# Altium schematic sheet Tu_Nguon_2.SchDoc
size A0; SheetNumber: 1; SheetTotal: 12
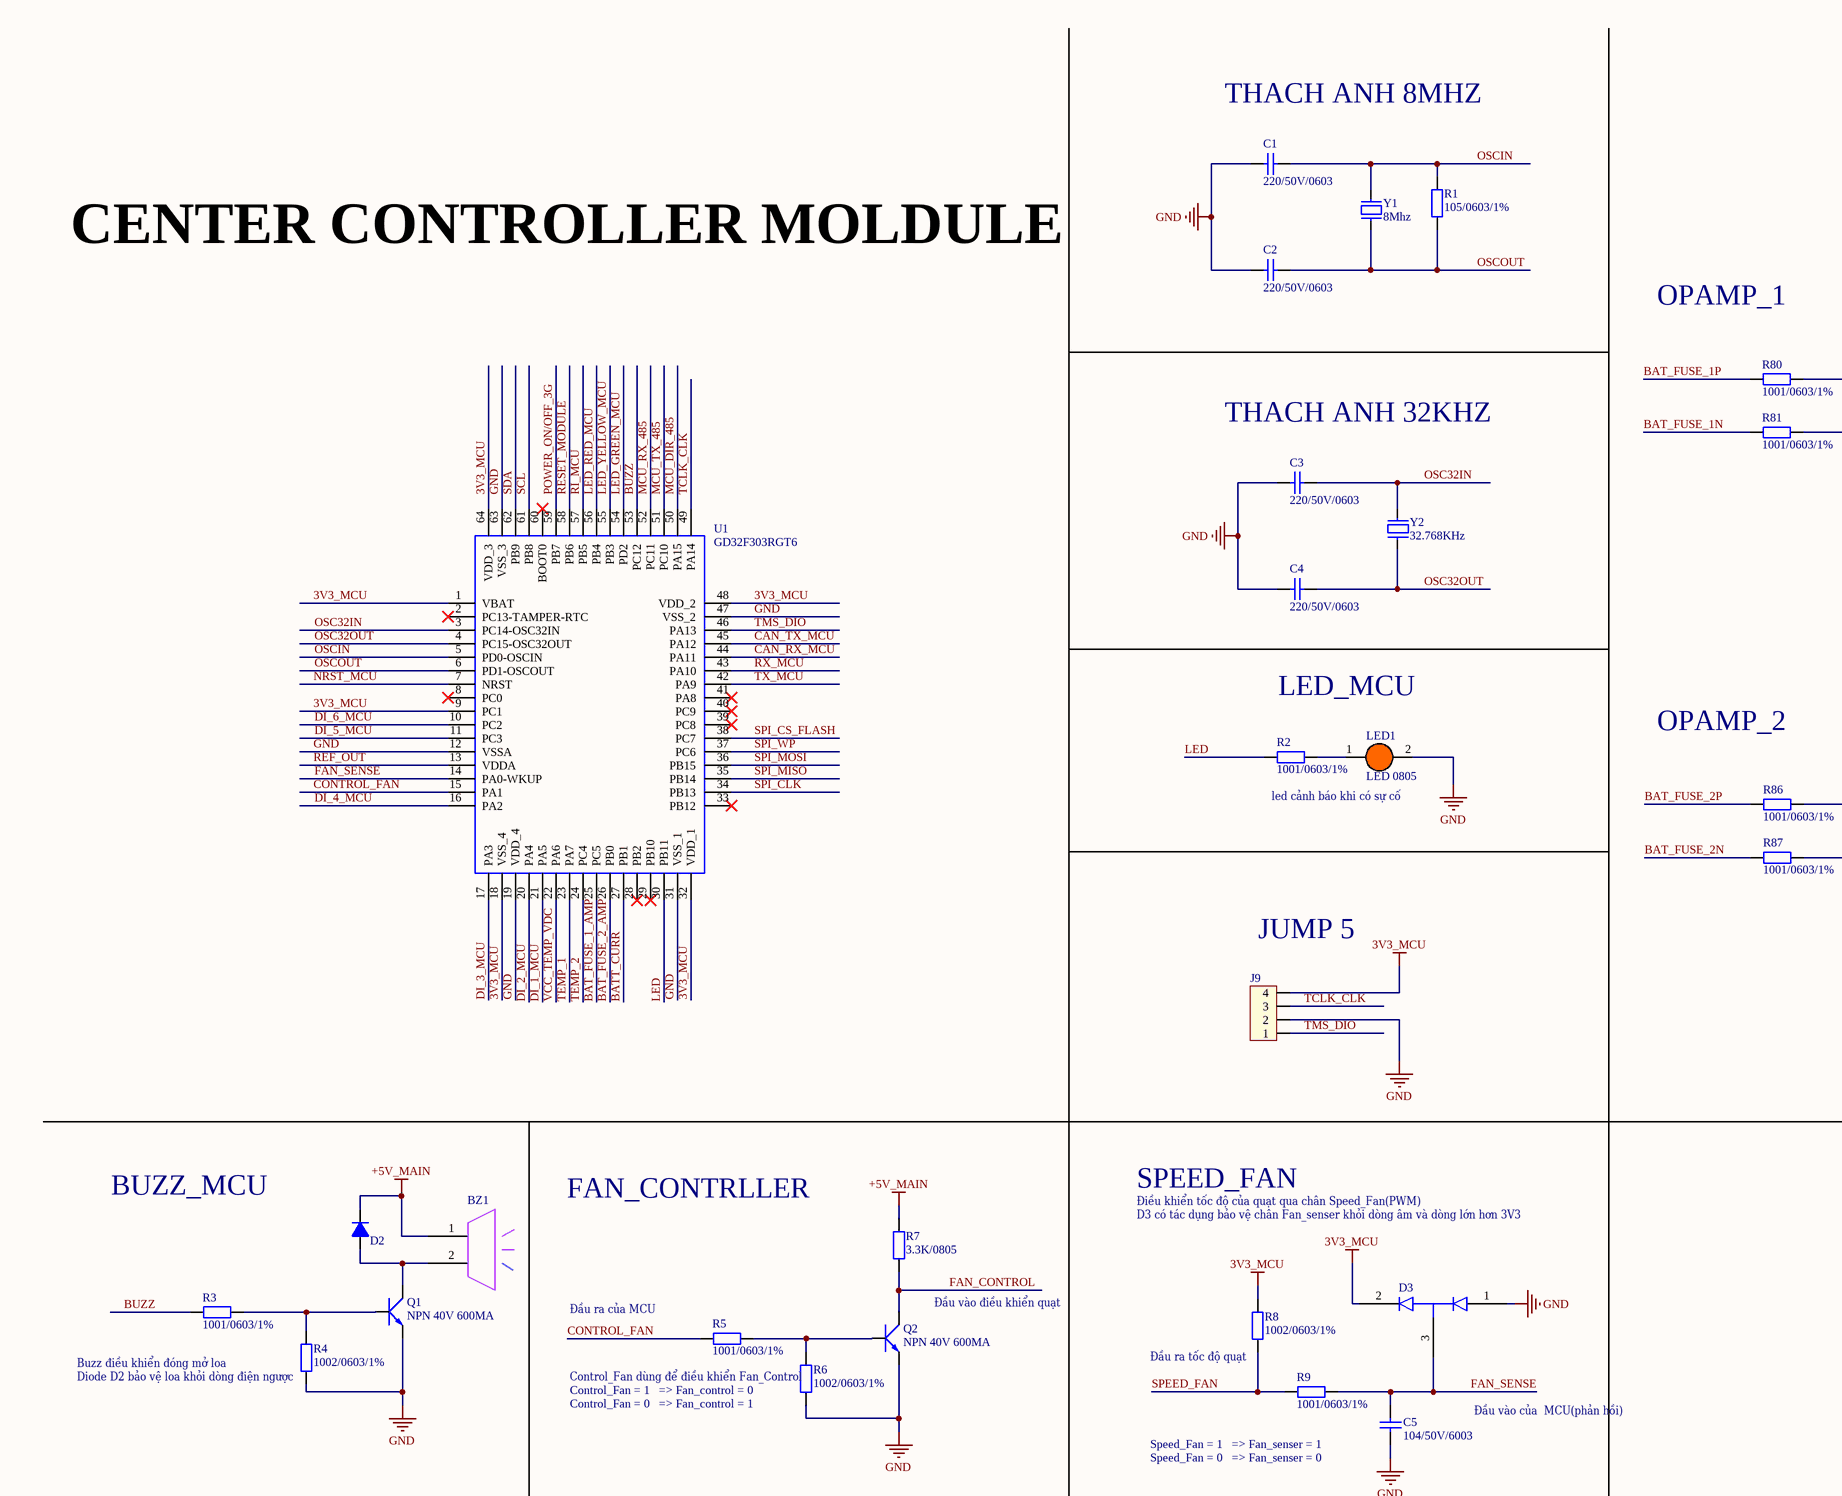
[diagram p0: Tu_Nguon_2.SchDoc, top left]
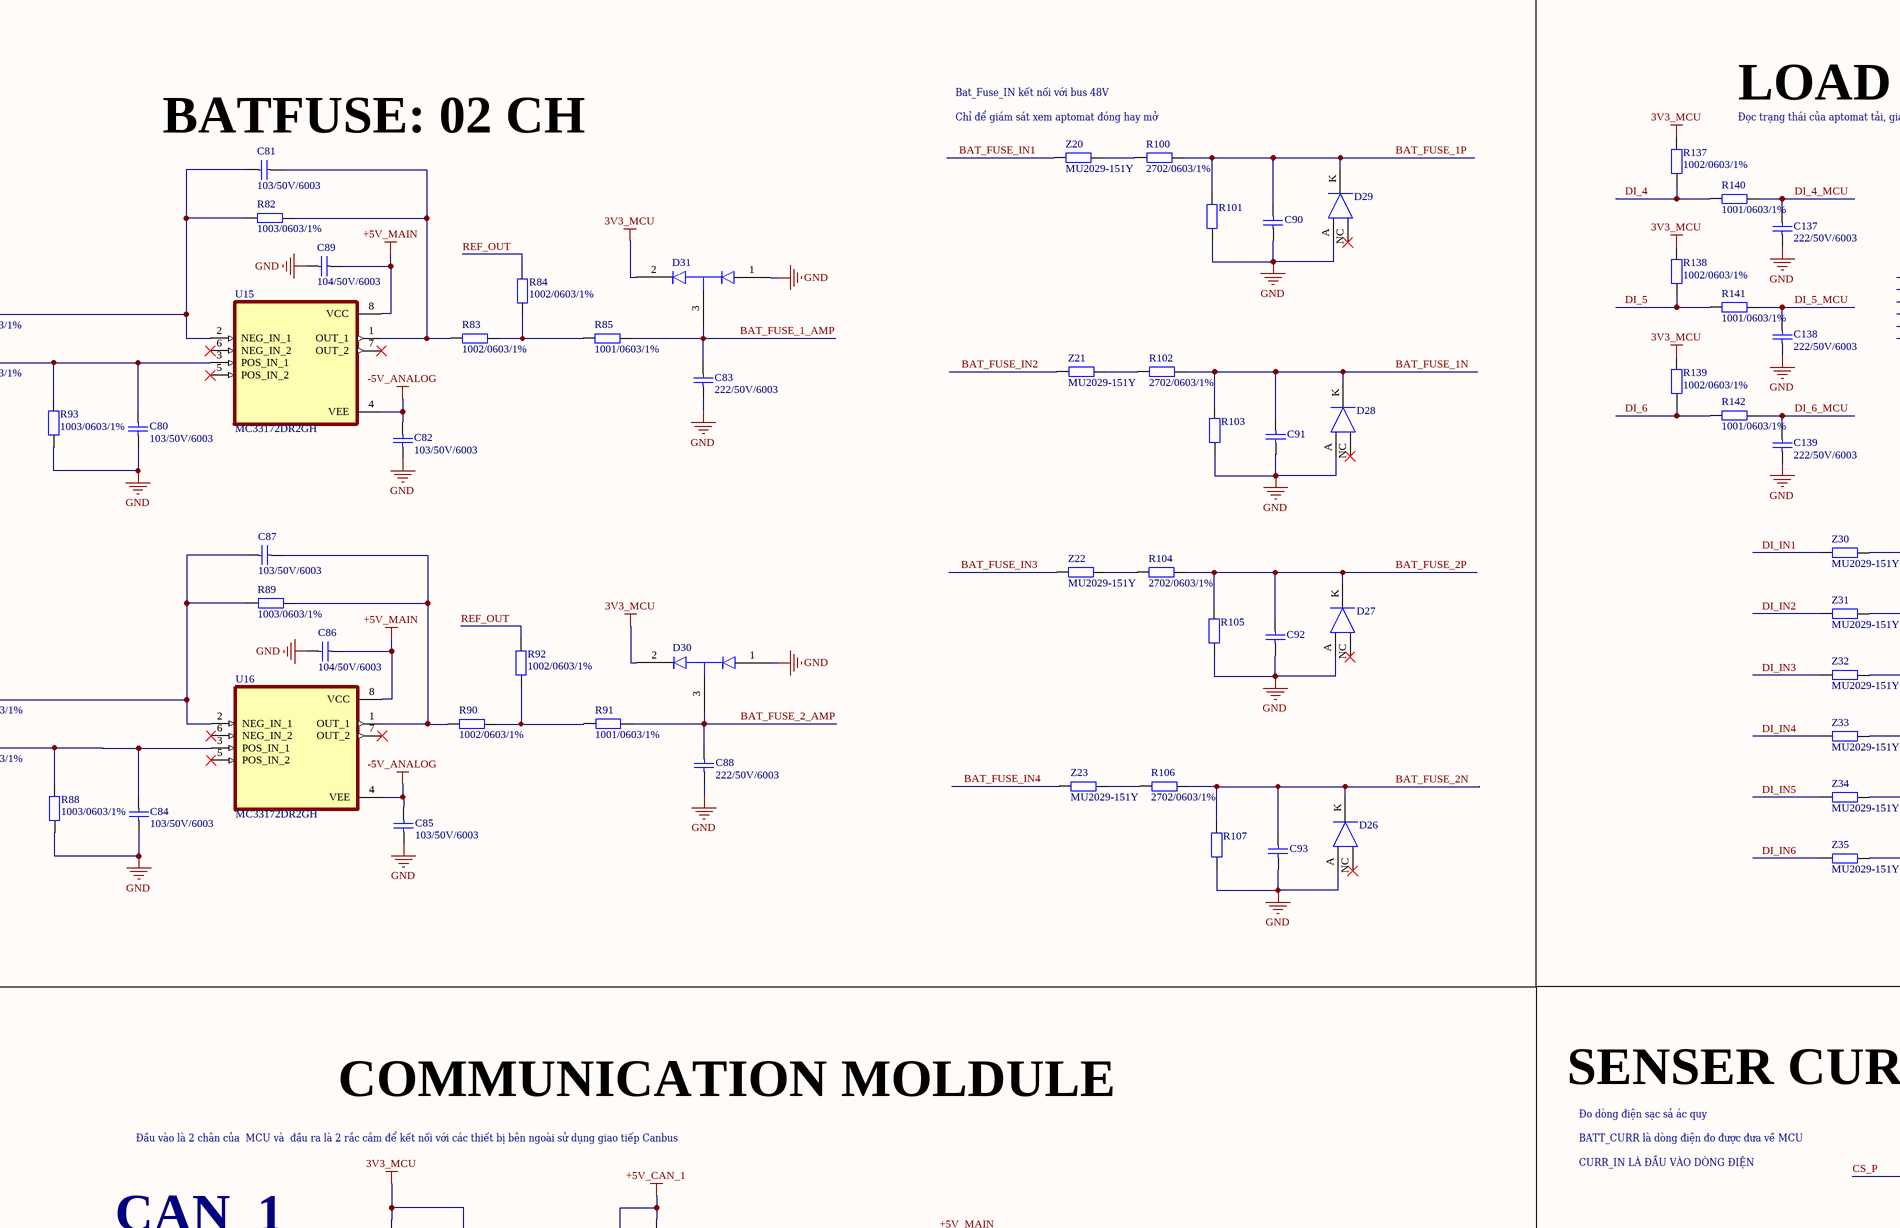
[diagram p1: Tu_Nguon_2.SchDoc, top middle]
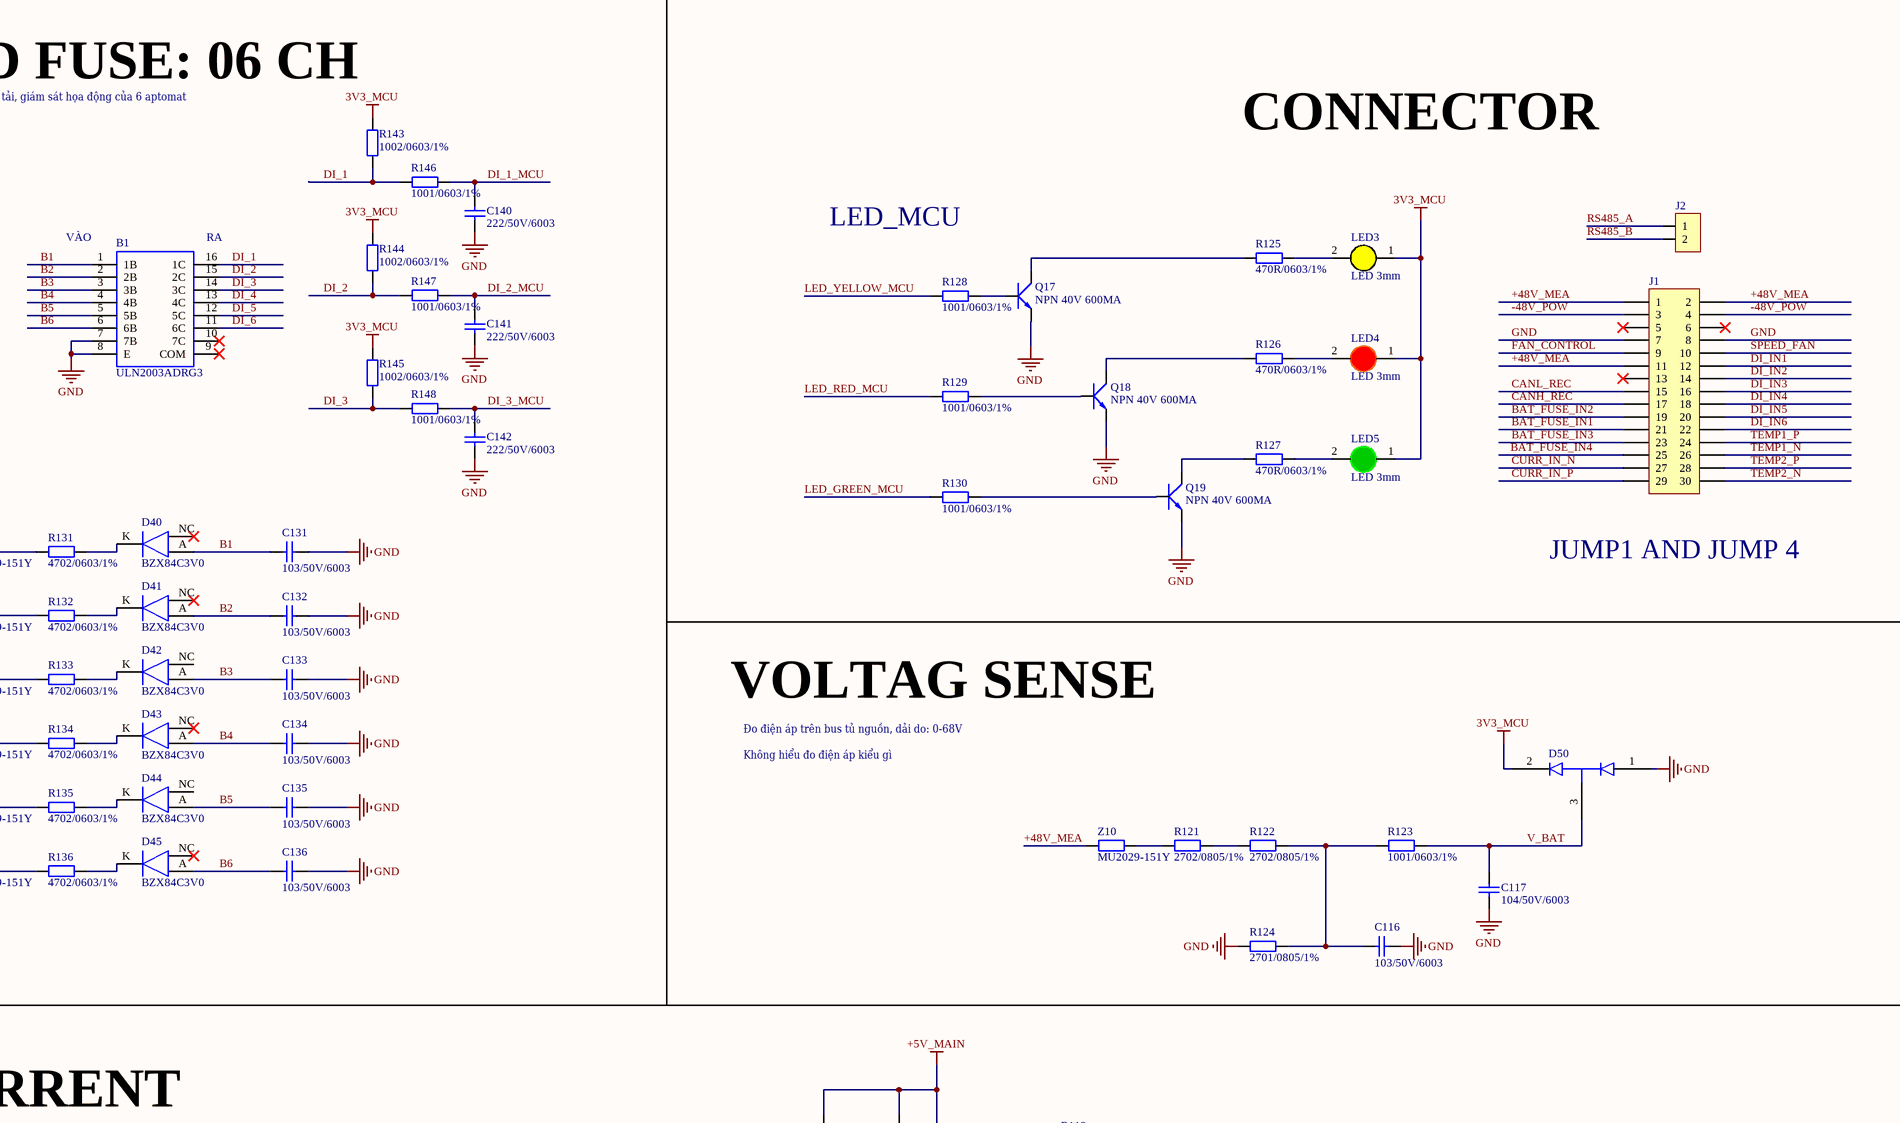
[diagram p2: Tu_Nguon_2.SchDoc, top right]
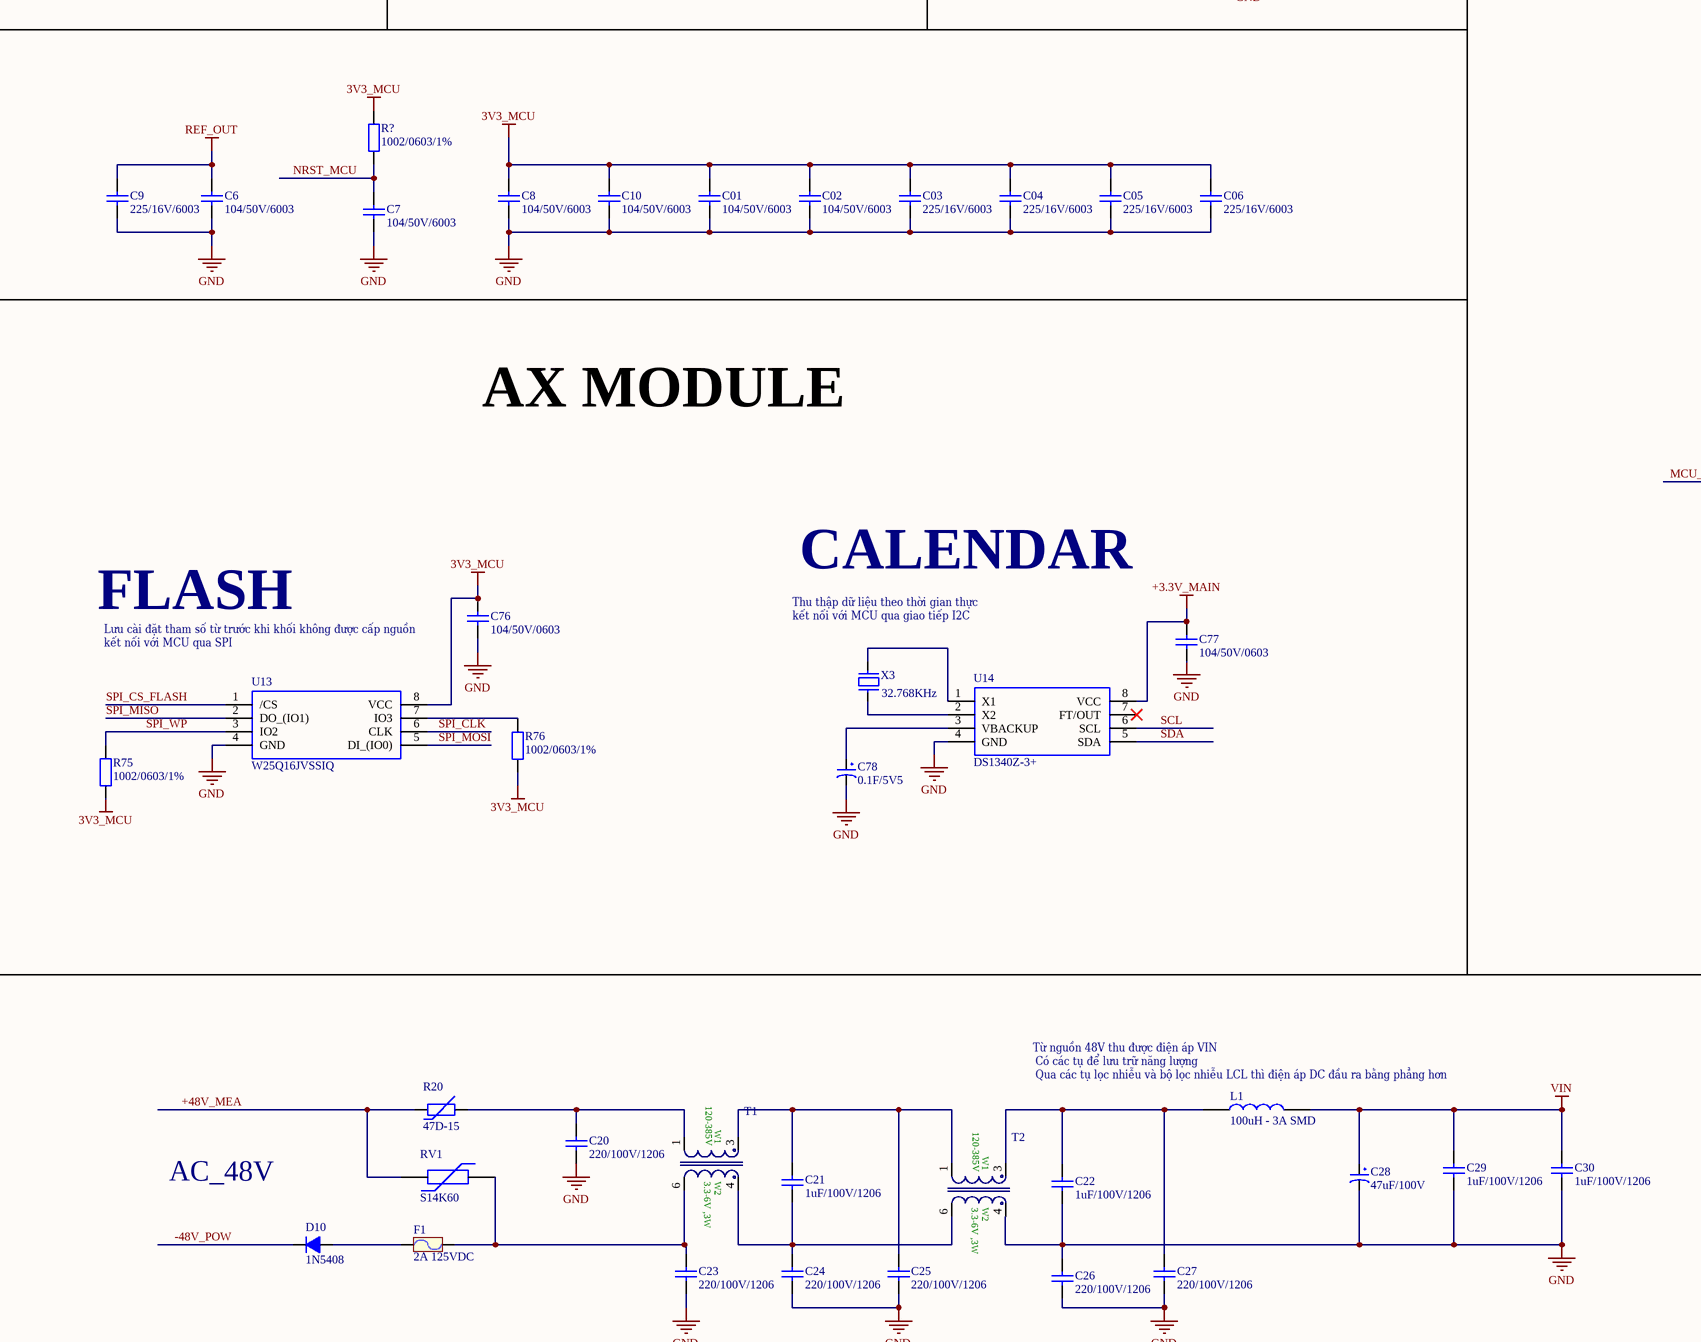
[diagram p3: Tu_Nguon_2.SchDoc, centre left]
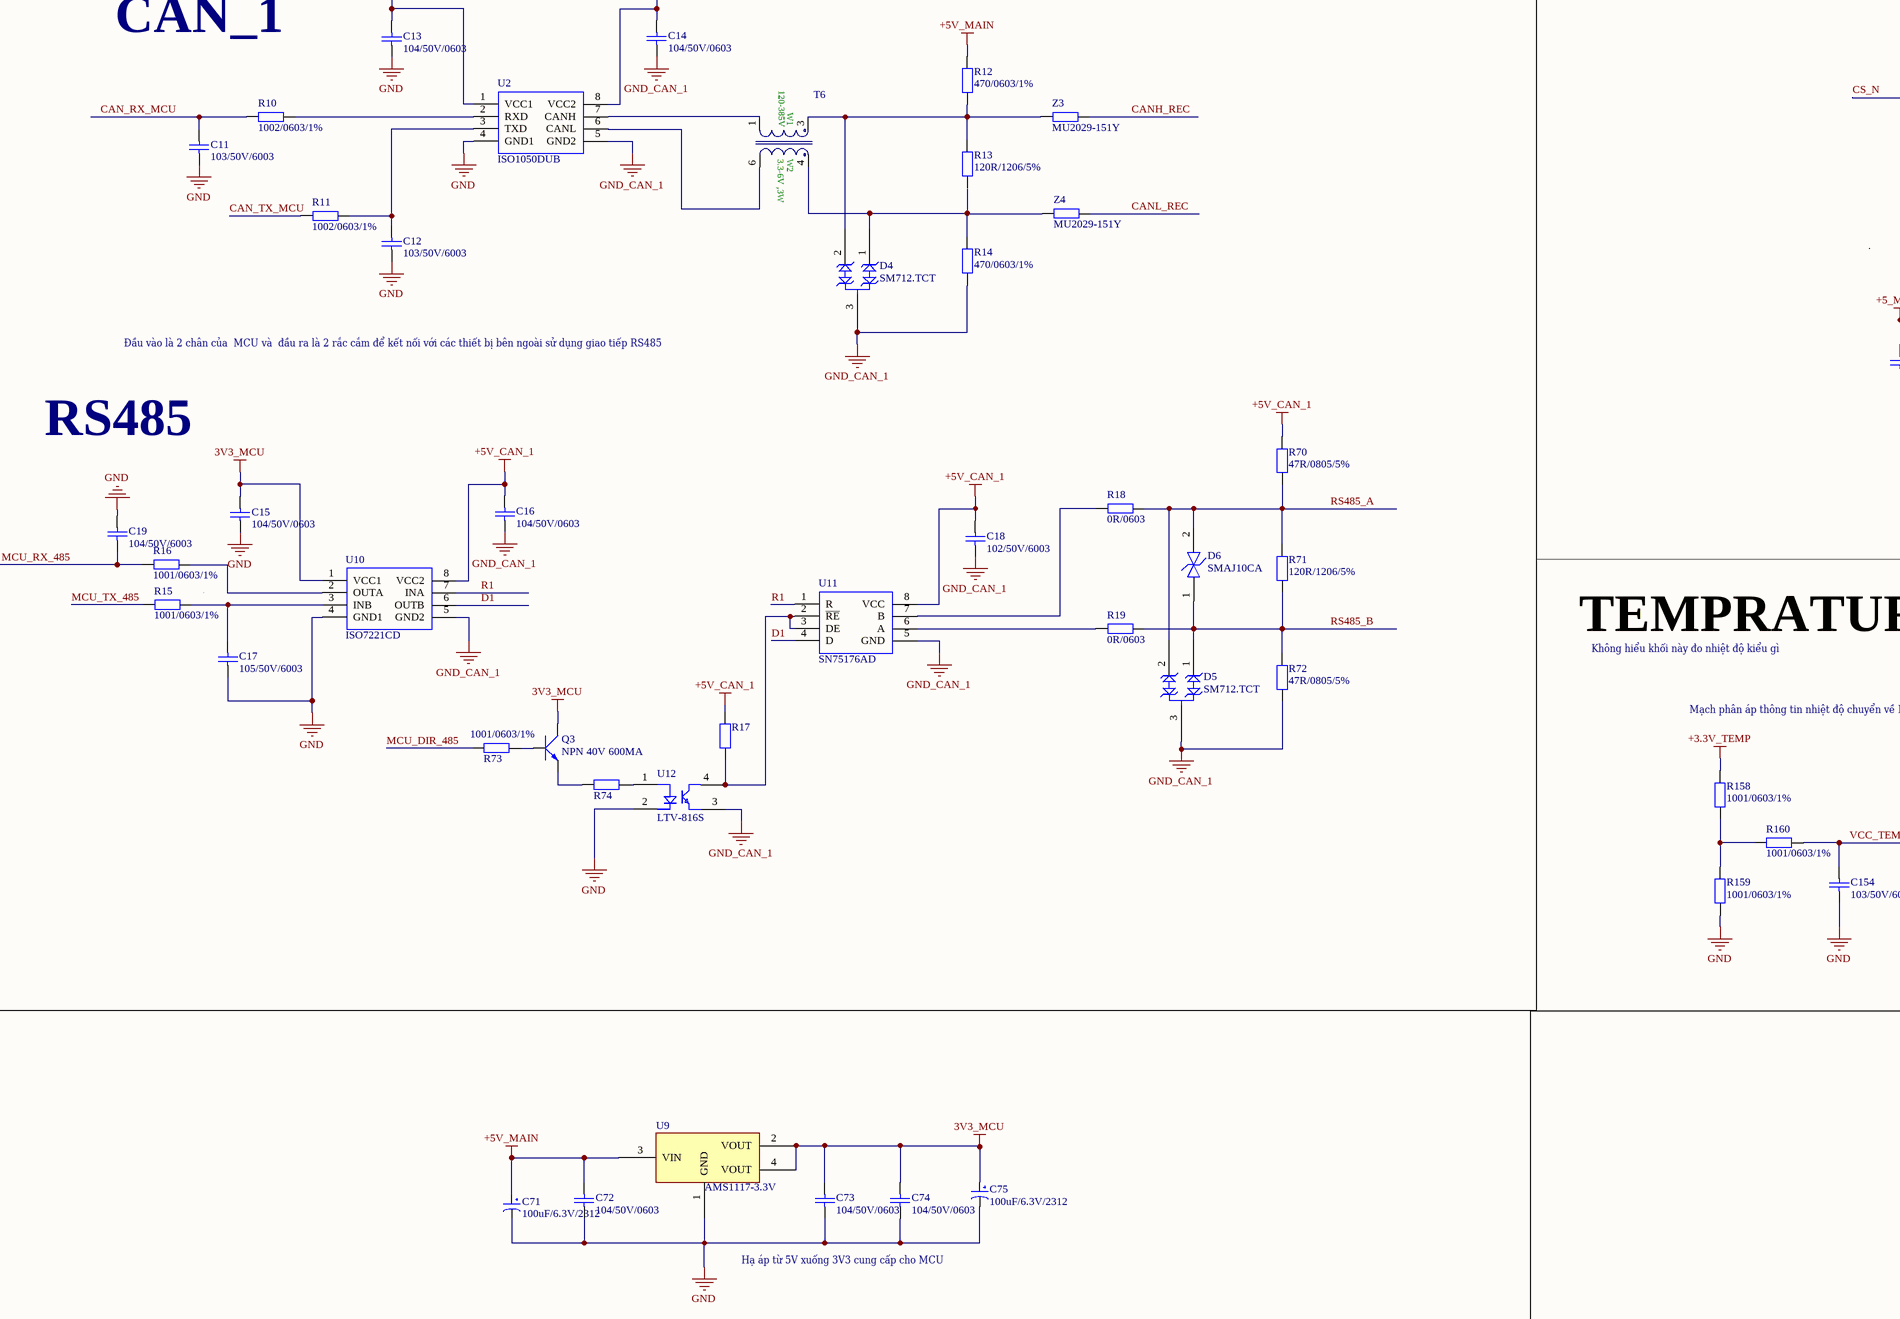
[diagram p4: Tu_Nguon_2.SchDoc, centre middle]
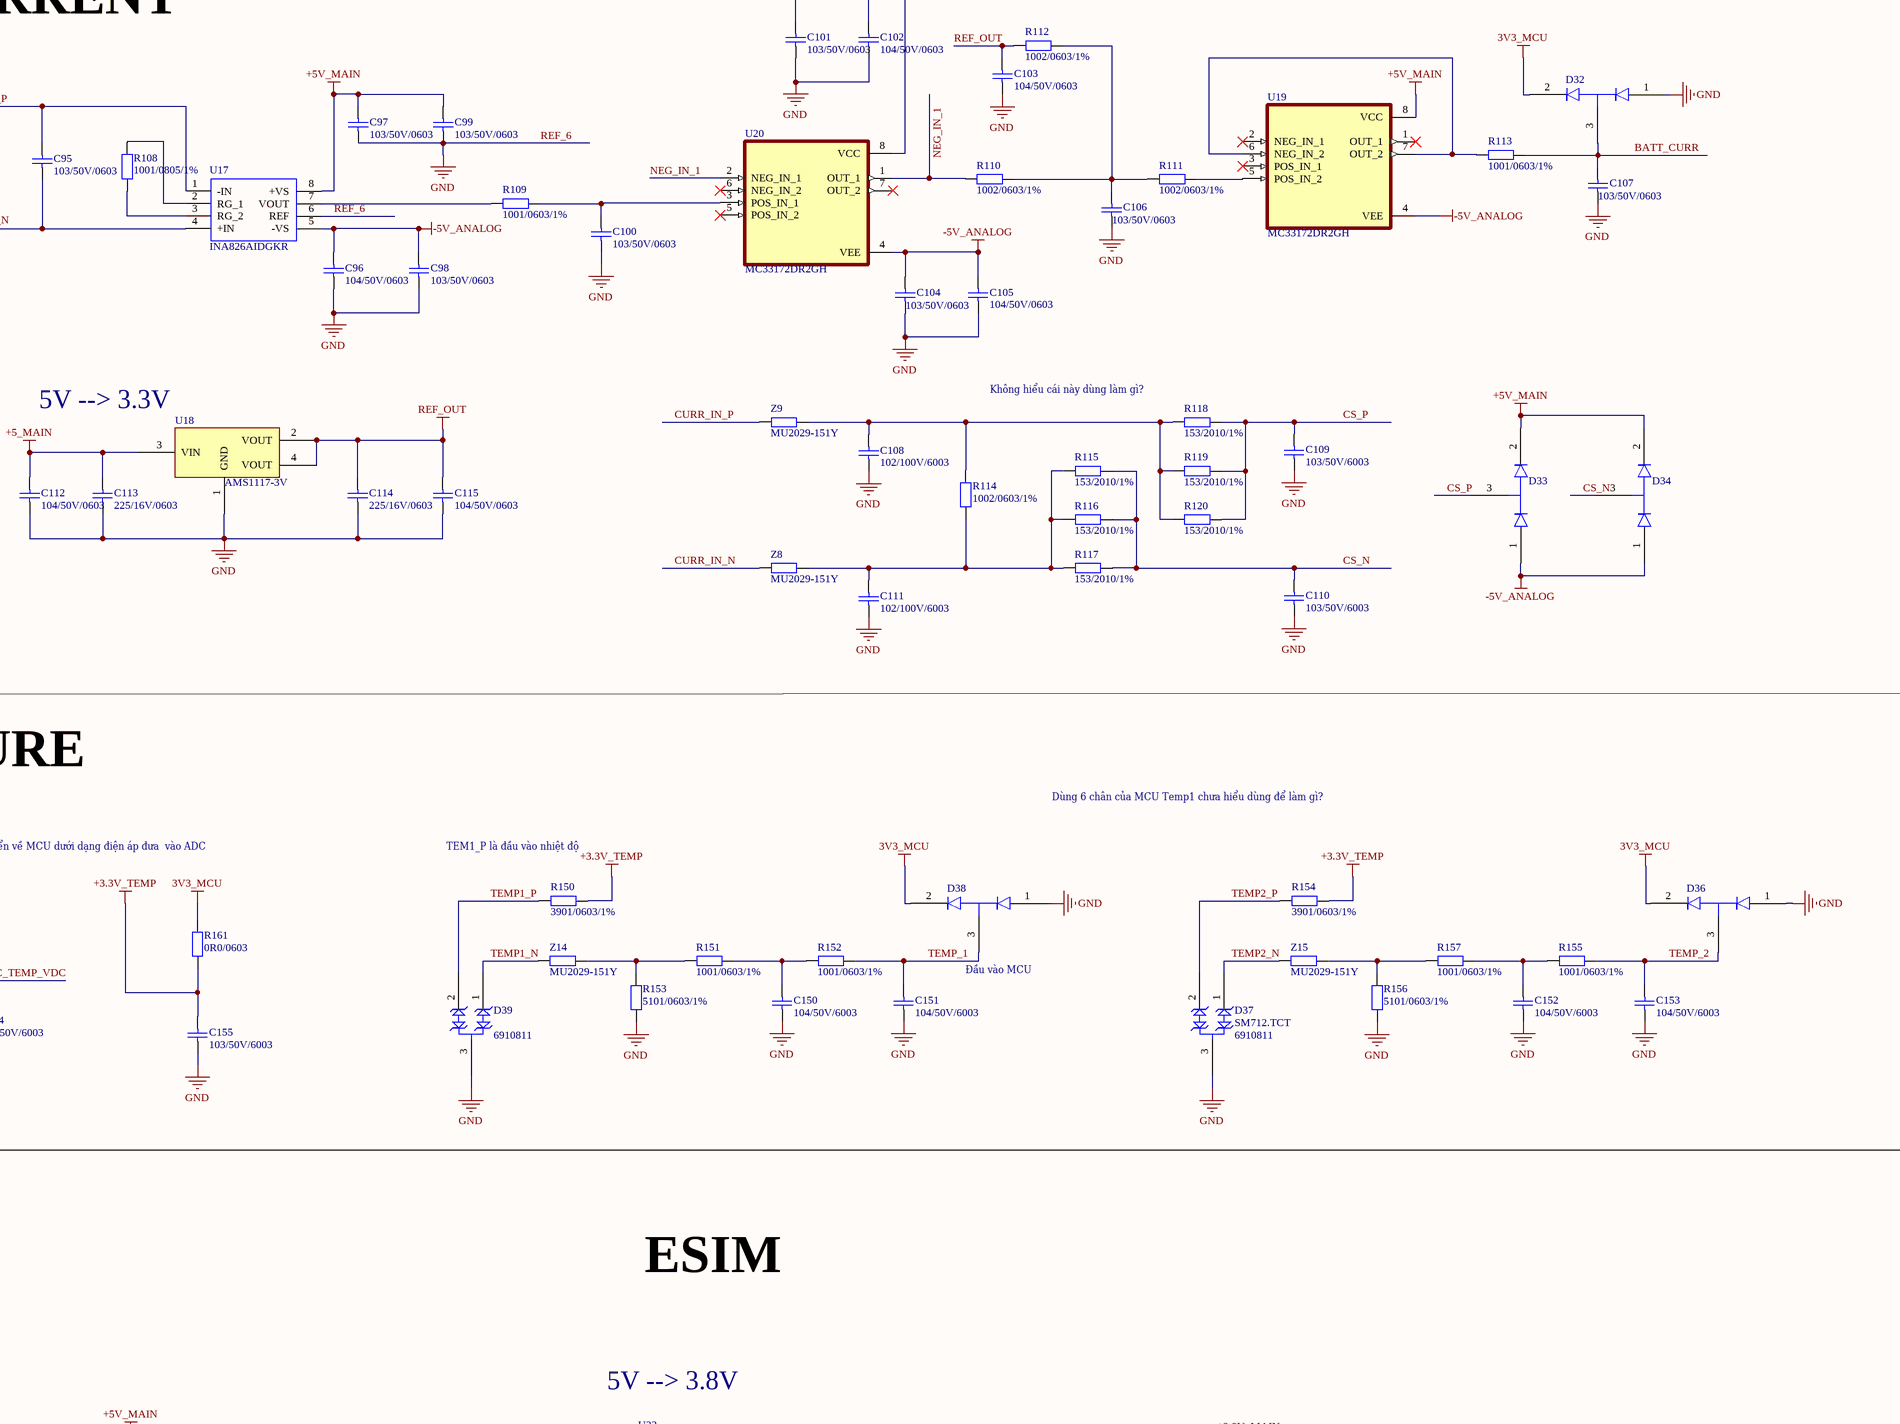
[diagram p5: Tu_Nguon_2.SchDoc, centre right]
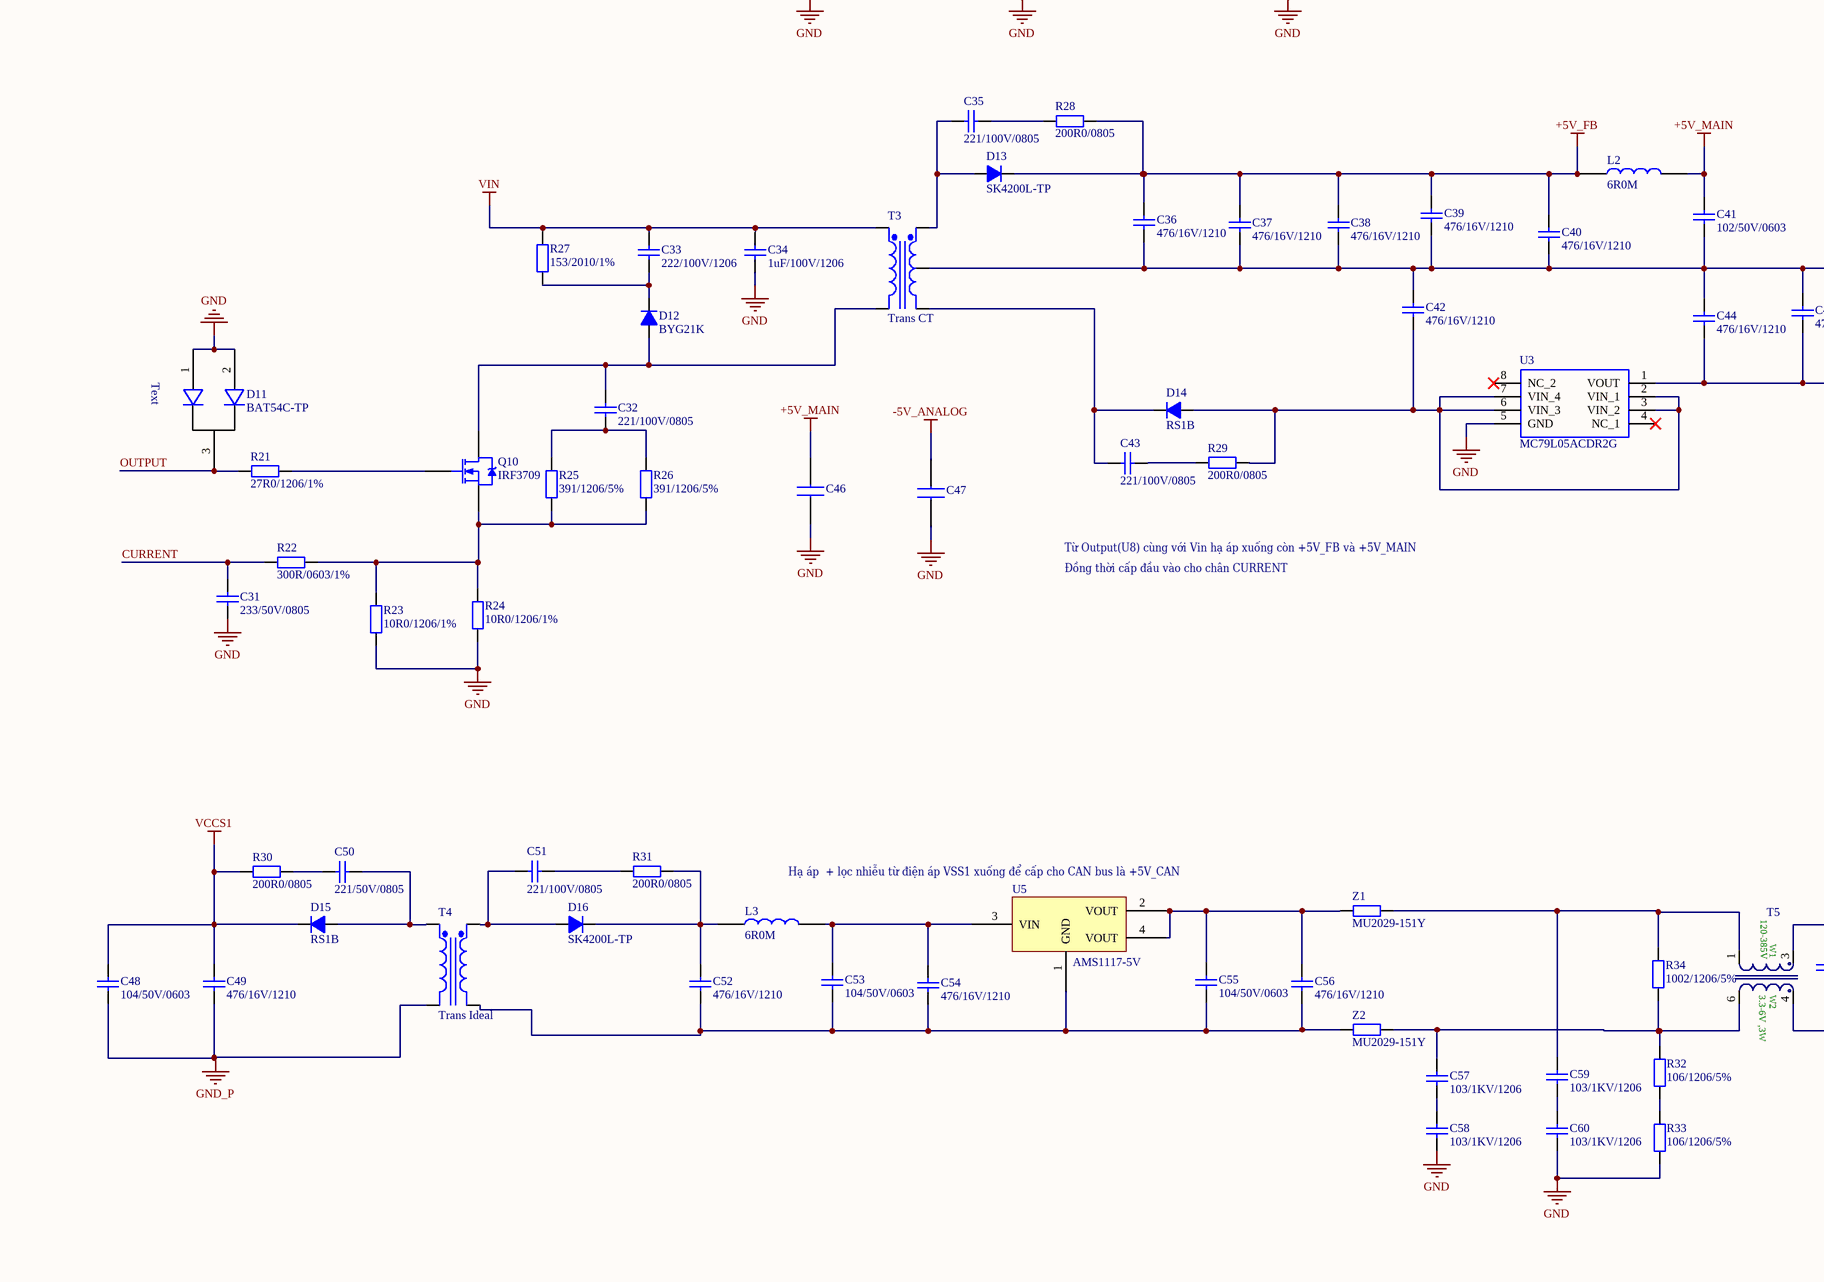
[diagram p6: Tu_Nguon_2.SchDoc, bottom left]
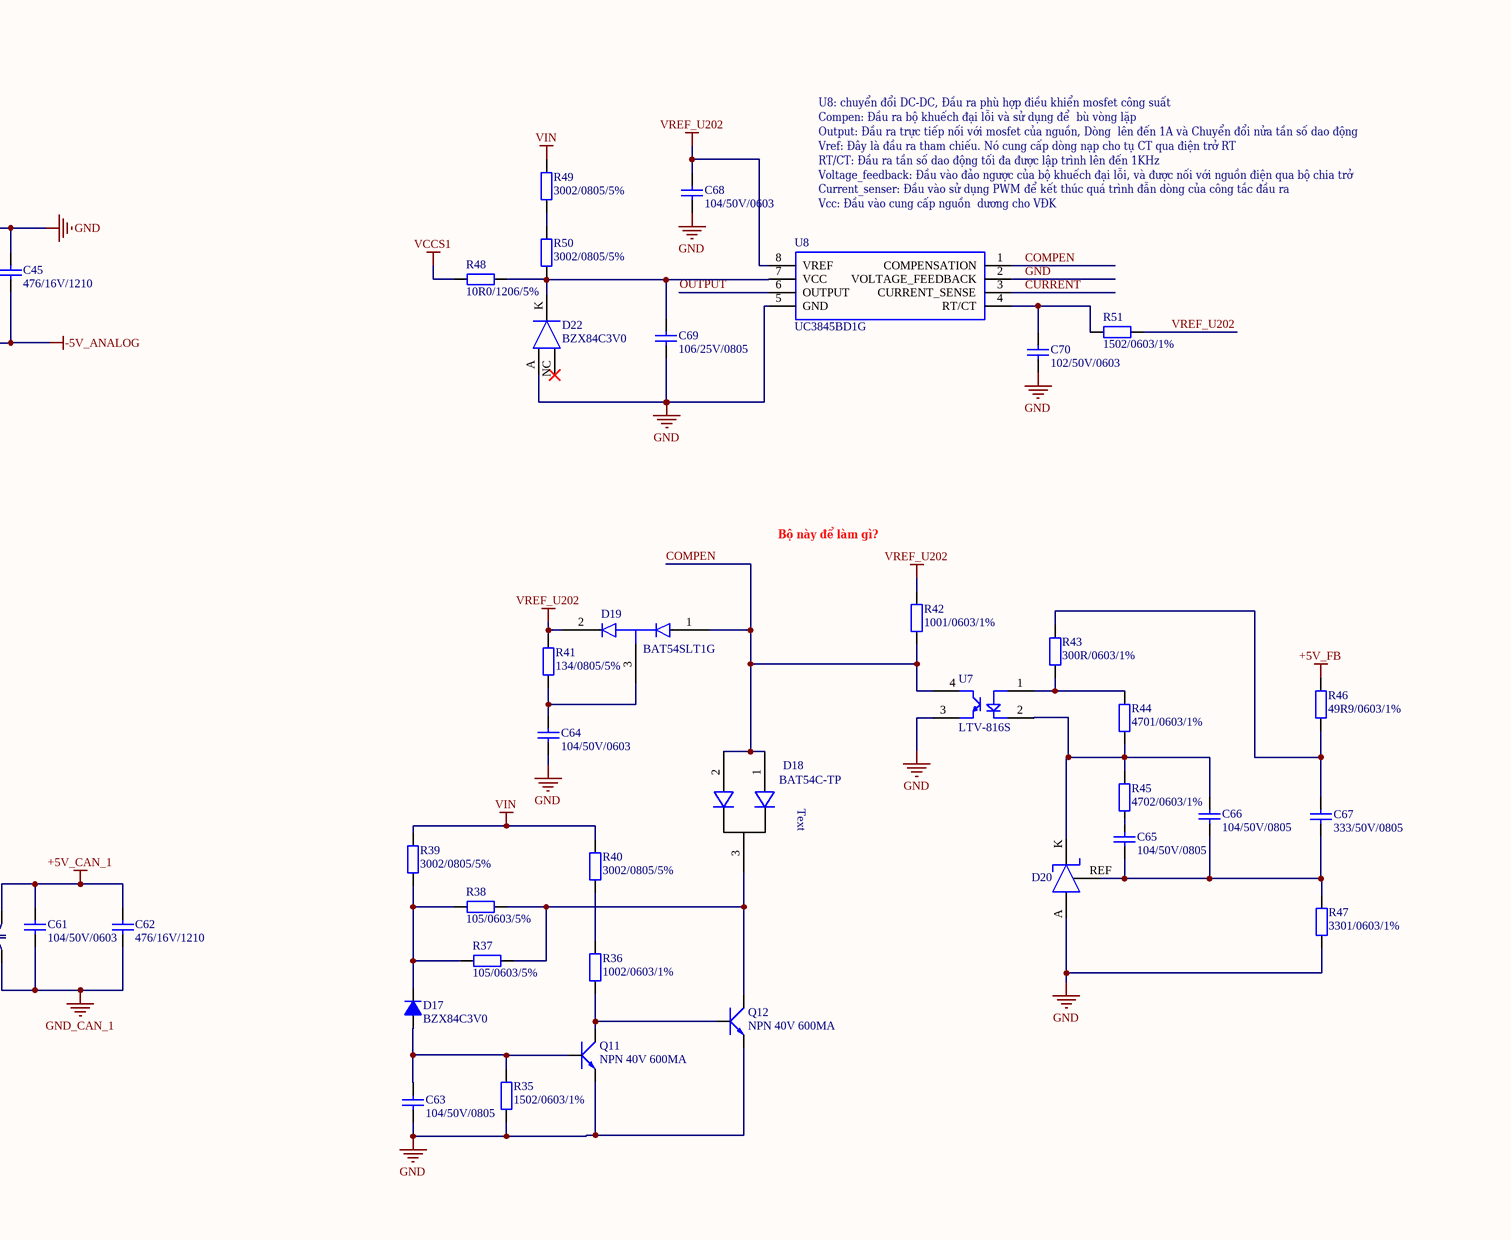
[diagram p7: Tu_Nguon_2.SchDoc, bottom middle]
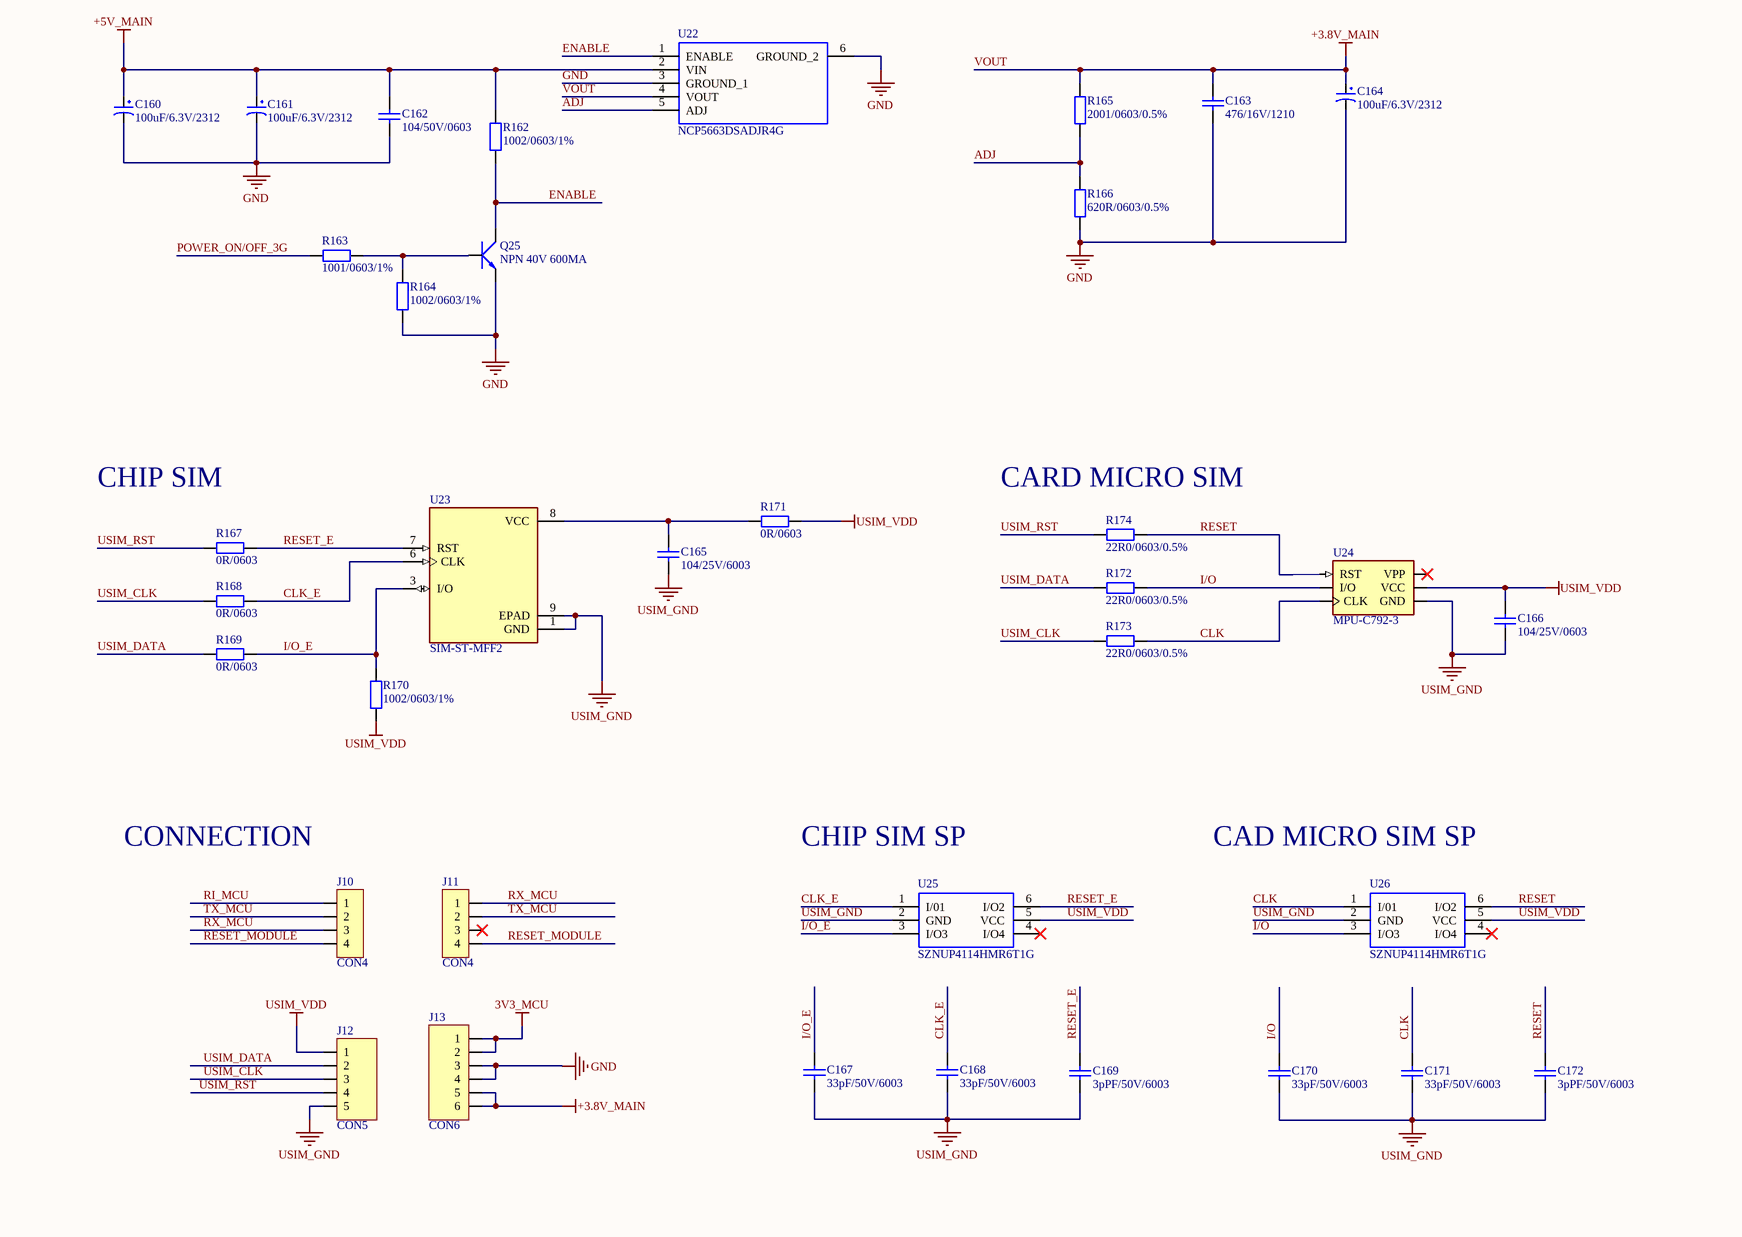
[diagram p8: Tu_Nguon_2.SchDoc, bottom right]

## Parts
B1  ULN2003ADRG3  [SOIC127P600X175-16N]
BZ1  Buzzer  [buzzer 5V]  (value not drawn)
C1  220/50V/0603  [tu 0603]
C01  104/50V/6003  [tu 0603]
C2  220/50V/0603  [tu 0603]
C02  104/50V/6003  [tu 0603]
C3  220/50V/0603  [tu 0603]
C03  225/16V/6003  [tu 0603]
C4  220/50V/0603  [tu 0603]
C04  225/16V/6003  [tu 0603]
C5  104/50V/6003  [tu 0603]
C05  225/16V/6003  [tu 0603]
C6  104/50V/6003  [tu 0603]
C06  225/16V/6003  [tu 0603]
C7  104/50V/6003  [tu 0603]
C8  104/50V/6003  [tu 0603]
C9  225/16V/6003  [tu 0603]
C10  104/50V/6003  [tu 0603]
C11  103/50V/6003  [tu 0603]
C12  103/50V/6003  [tu 0603]
C13  104/50V/0603  [tu 0603]
C14  104/50V/0603  [tu 0603]
C15  104/50V/0603  [tu 0603]
C16  104/50V/0603  [tu 0603]
C17  105/50V/6003  [tu 0603]
C18  102/50V/6003  [tu 0603]
C19  104/50V/6003  [tu 0603]
C20  220/100V/1206  [tu 1206]
C21  1uF/100V/1206  [tu 1206]
C22  1uF/100V/1206  [tu 1206]
C23  220/100V/1206  [tu 1206]
C24  220/100V/1206  [tu 1206]
C25  220/100V/1206  [tu 1206]
C26  220/100V/1206  [tu 1206]
C27  220/100V/1206  [tu 1206]
C28  47uF/100V  [tu hoa 5mm]
C29  1uF/100V/1206  [tu 1206]
C30  1uF/100V/1206  [tu 1206]
C31  233/50V/0805  [tu 0805]
C32  221/100V/0805  [tu 0805]
C33  222/100V/1206  [tu 1206]
C34  1uF/100V/1206  [tu 1206]
C35  221/100V/0805  [tu 0805]
C36  476/16V/1210  [tu 0603]
C37  476/16V/1210  [tu 0603]
C38  476/16V/1210  [tu 0603]
C39  476/16V/1210  [tu 0603]
C40  476/16V/1210  [tu 0603]
C41  102/50V/0603  [tu 0603]
C42  476/16V/1210  [tu 0603]
C43  221/100V/0805  [tu 0805]
C44  476/16V/1210  [tu 0603]
C45  476/16V/1210  [tu 0603]
C46  MKP1837410011  [MKP1837410011]  (value not drawn)
C47  MKP1837410011  [MKP1837410011]  (value not drawn)
C48  104/50V/0603  [tu 0603]
C49  476/16V/1210  [tu 0603]
C50  221/50V/0805  [tu 0805]
C51  221/100V/0805  [tu 0805]
C52  476/16V/1210  [tu 0603]
C53  104/50V/0603  [tu 0603]
C54  476/16V/1210  [tu 0603]
C55  104/50V/0603  [tu 0603]
C56  476/16V/1210  [tu 0603]
C57  103/1KV/1206  [tu 1206]
C58  103/1KV/1206  [tu 1206]
C59  103/1KV/1206  [tu 1206]
C60  103/1KV/1206  [tu 1206]
C61  104/50V/0603  [tu 0603]
C62  476/16V/1210  [tu 0603]
C63  104/50V/0805  [tu 0805]
C64  104/50V/0603  [tu 0603]
C65  104/50V/0805  [tu 0805]
C66  104/50V/0805  [tu 0805]
C67  333/50V/0805  [tu 0805]
C68  104/50V/0603  [tu 0603]
C69  106/25V/0805  [tu 0805]
C70  102/50V/0603  [tu 0603]
C71  100uF/6.3V/2312  [tu tantalum smd3528]
C72  104/50V/0603  [tu 0603]
C73  104/50V/0603  [tu 0603]
C74  104/50V/0603  [tu 0603]
C75  100uF/6.3V/2312  [tu tantalum smd3528]
C76  104/50V/0603  [tu 0603]
C77  104/50V/0603  [tu 0603]
C78  0.1F/5V5  [CP4.5/19]
C80  103/50V/6003  [tu 0603]
C81  103/50V/6003  [tu 0603]
C82  103/50V/6003  [tu 0603]
C83  222/50V/6003  [tu 0603]
C84  103/50V/6003  [tu 0603]
C85  103/50V/6003  [tu 0603]
C86  104/50V/6003  [tu 0603]
C87  103/50V/6003  [tu 0603]
C88  222/50V/6003  [tu 0603]
C89  104/50V/6003  [tu 0603]
C90  104/50V/6003  [tu 0603]  (value not drawn)
C91  104/50V/6003  [tu 0603]  (value not drawn)
C92  104/50V/6003  [tu 0603]  (value not drawn)
C93  104/50V/6003  [tu 0603]  (value not drawn)
C95  103/50V/0603  [tu 0603]
C96  104/50V/0603  [tu 0603]
C97  103/50V/0603  [tu 0603]
C98  103/50V/0603  [tu 0603]
C99  103/50V/0603  [tu 0603]
C100  103/50V/0603  [tu 0603]
C101  103/50V/0603  [tu 0603]
C102  104/50V/0603  [tu 0603]
C103  104/50V/0603  [tu 0603]
C104  103/50V/0603  [tu 0603]
C105  104/50V/0603  [tu 0603]
C106  103/50V/0603  [tu 0603]
C107  103/50V/0603  [tu 0603]
C108  102/100V/6003  [tu 0603]
C109  103/50V/6003  [tu 0603]
C110  103/50V/6003  [tu 0603]
C111  102/100V/6003  [tu 0603]
C112  104/50V/0603  [tu 0603]
C113  225/16V/0603  [tu 0603]
C114  225/16V/0603  [tu 0603]
C115  104/50V/0603  [tu 0603]
C116  103/50V/6003  [tu 0603]
C117  104/50V/6003  [tu 0603]
C131  103/50V/6003  [tu 0603]
C132  103/50V/6003  [tu 0603]
C133  103/50V/6003  [tu 0603]
C134  103/50V/6003  [tu 0603]
C135  103/50V/6003  [tu 0603]
C136  103/50V/6003  [tu 0603]
C137  222/50V/6003  [tu 0603]
C138  222/50V/6003  [tu 0603]
C139  222/50V/6003  [tu 0603]
C140  222/50V/6003  [tu 0603]
C141  222/50V/6003  [tu 0603]
C142  222/50V/6003  [tu 0603]
C150  104/50V/6003  [tu 0603]
C151  104/50V/6003  [tu 0603]
C152  104/50V/6003  [tu 0603]
C153  104/50V/6003  [tu 0603]
C154  103/50V/6003  [tu 0603]
C155  103/50V/6003  [tu 0603]
C160  100uF/6.3V/2312  [tu tantalum smd3528]
C161  100uF/6.3V/2312  [tu tantalum smd3528]
C162  104/50V/0603  [tu 0603]
C163  476/16V/1210  [tu 0603]
C164  100uF/6.3V/2312  [tu tantalum smd3528]
C165  104/25V/6003  [tu 0603]
C166  104/25V/0603  [tu 0603]
C167  33pF/50V/6003  [tu 0603]
C168  33pF/50V/6003  [tu 0603]
C169  3pPF/50V/6003  [tu 0603]
C170  33pF/50V/6003  [tu 0603]
C171  33pF/50V/6003  [tu 0603]
C172  3pPF/50V/6003  [tu 0603]
D2  Diode  1N4007  [DO-214AC]  (value not drawn)
D3  BAT54SLT1G  [SOT96P237X111-3N]  (value not drawn)
D4  SM712.TCT  [SOT95P237X112-3N]
D5  SM712.TCT  [SOT95P237X112-3N]
D6  SMAJ10CA  [DIONM5026X229N]
D10  1N5408  [D5A]
D11  BAT54C-TP  [BAT54CTP]
D12  BYG21K  [DIODE 0.5A]
D13  SK4200L-TP  [DIODE 0.5A]
D14  RS1B  [DIODE 0.5A]
D15  RS1B  [DIODE 0.5A]
D16  SK4200L-TP  [DIODE 0.5A]
D17  BZX84C3V0  [DIODE 1A]
D18  BAT54C-TP  [BAT54CTP]
D19  BAT54SLT1G  [SOT96P237X111-3N]
D20  TL432BIDBZR  [SOT95P237X112-3N]  (value not drawn)
D22  BZX84C3V0  [SOT91P240X110-3N]
D26  BZX84C3V0  [SOT91P240X110-3N]  (value not drawn)
D27  BZX84C3V0  [SOT91P240X110-3N]  (value not drawn)
D28  BZX84C3V0  [SOT91P240X110-3N]  (value not drawn)
D29  BZX84C3V0  [SOT91P240X110-3N]  (value not drawn)
D30  BAT54SLT1G  [SOT96P237X111-3N]  (value not drawn)
D31  BAT54SLT1G  [SOT96P237X111-3N]  (value not drawn)
D32  BAT54SLT1G  [SOT96P237X111-3N]  (value not drawn)
D33  BAT54SLT1G  [SOT96P237X111-3N]  (value not drawn)
D34  BAT54SLT1G  [SOT96P237X111-3N]  (value not drawn)
D36  BAT54SLT1G  [SOT96P237X111-3N]  (value not drawn)
D37  SM712.TCT  Supplier Part Number 1: 6910811  [SOT95P237X112-3N]
D38  BAT54SLT1G  [SOT96P237X111-3N]  (value not drawn)
D39  Supplier Part Number 1: 6910811  [SOT95P237X112-3N]  (hidden comment: SM712.TCT)
D40  BZX84C3V0  [SOT91P240X110-3N]
D41  BZX84C3V0  [SOT91P240X110-3N]
D42  BZX84C3V0  [SOT91P240X110-3N]
D43  BZX84C3V0  [SOT91P240X110-3N]
D44  BZX84C3V0  [SOT91P240X110-3N]
D45  BZX84C3V0  [SOT91P240X110-3N]
D50  BAT54SLT1G  [SOT96P237X111-3N]  (value not drawn)
F1  2A 125VDC  [Cau Chi SMD1808]
J1  CONN2X15  [HDR2X15]  (value not drawn)
J2  MTJ_889X1_FSE  [JP 1x2 DT]  (value not drawn)
J9  Con4  [CON4]  (value not drawn)
J10  CON4  [JP 1x4 DT]
J11  CON4  [JP 1x4 DT]
J12  CON5  [JP 1x5 DT]
J13  CON6  [JP 1x6 DT]
L1  100uH - 3A SMD  [Cuon Cam 12x12x10]
L2  6R0M  [Cuon Cam 12x12x10]
L3  6R0M  [Cuon Cam 12x12x10]
LED1  LED 0805  [LED-0805-Orange]
LED3  LED 3mm  [LED-3MM-YELLOW]
LED4  LED 3mm  [LED-3MM-RED]
LED5  LED 3mm  [LED-3MM-GREEN]
Q1  NPN 40V 600MA  [QTO-92]
Q2  NPN 40V 600MA  [QTO-92]
Q3  NPN 40V 600MA  [QTO-92]
Q10  IRF3709  [D2PAK]
Q11  NPN 40V 600MA  [QTO-92]
Q12  NPN 40V 600MA  [QTO-92]
Q17  NPN 40V 600MA  [QTO-92]
Q18  NPN 40V 600MA  [QTO-92]
Q19  NPN 40V 600MA  [QTO-92]
Q25  NPN 40V 600MA  [QTO-92]
R1  105/0603/1%  [tro smd 0603]
R2  1001/0603/1%  [tro smd 0603]
R3  1001/0603/1%  [tro smd 0603]
R4  1002/0603/1%  [tro smd 0603]
R5  1001/0603/1%  [tro smd 0603]
R6  1002/0603/1%  [tro smd 0603]
R7  3.3K/0805  [tro smd 0805]
R8  1002/0603/1%  [tro smd 0603]
R9  1001/0603/1%  [tro smd 0603]
R10  1002/0603/1%  [tro smd 0603]
R11  1002/0603/1%  [tro smd 0603]
R12  470/0603/1%  [tro smd 0603]
R13  120R/1206/5%  [tro smd 1206]
R14  470/0603/1%  [tro smd 0603]
R15  1001/0603/1%  [tro smd 0603]
R16  1001/0603/1%  [tro smd 0603]
R17  1002/0603/1%  [tro smd 0603]  (value not drawn)
R18  0R/0603  [tro smd 0603]
R19  0R/0603  [tro smd 0603]
R20  47D-15  [tro nhiet d15]
R21  27R0/1206/1%  [tro smd 1206]
R22  300R/0603/1%  [tro smd 0603]
R23  10R0/1206/1%  [tro smd 1206]
R24  10R0/1206/1%  [tro smd 1206]
R25  391/1206/5%  [tro smd 1206]
R26  391/1206/5%  [tro smd 1206]
R27  153/2010/1%  [tro smd 2010]
R28  200R0/0805  [tro smd 0805]
R29  200R0/0805  [tro smd 0805]
R30  200R0/0805  [tro smd 0805]
R31  200R0/0805  [tro smd 0805]
R32  106/1206/5%  [tro smd 1206]
R33  106/1206/5%  [tro smd 1206]
R34  1002/1206/5%  [tro smd 1206]
R35  1502/0603/1%  [tro smd 0603]
R36  1002/0603/1%  [tro smd 0603]
R37  105/0603/5%  [tro smd 0603]
R38  105/0603/5%  [tro smd 0603]
R39  3002/0805/5%  [tro smd 0805]
R40  3002/0805/5%  [tro smd 0805]
R41  134/0805/5%  [tro smd 0805]
R42  1001/0603/1%  [tro smd 0603]
R43  300R/0603/1%  [tro smd 0603]
R44  4701/0603/1%  [tro smd 0603]
R45  4702/0603/1%  [tro smd 0603]
R46  49R9/0603/1%  [tro smd 0603]
R47  3301/0603/1%  [tro smd 0603]
R48  10R0/1206/5%  [tro smd 1206]
R49  3002/0805/5%  [tro smd 0805]
R50  3002/0805/5%  [tro smd 0805]
R51  1502/0603/1%  [tro smd 0603]
R70  47R/0805/5%  [tro smd 0805]
R71  120R/1206/5%  [tro smd 1206]
R72  47R/0805/5%  [tro smd 0805]
R73  1001/0603/1%  [tro smd 0603]
R74  241/0603/1%  [tro smd 0603]  (value not drawn)
R75  1002/0603/1%  [tro smd 0603]
R76  1002/0603/1%  [tro smd 0603]
R80  1001/0603/1%  [tro smd 0603]
R81  1001/0603/1%  [tro smd 0603]
R82  1003/0603/1%  [tro smd 0603]
R83  1002/0603/1%  [tro smd 0603]
R84  1002/0603/1%  [tro smd 0603]
R85  1001/0603/1%  [tro smd 0603]
R86  1001/0603/1%  [tro smd 0603]
R87  1001/0603/1%  [tro smd 0603]
R88  1003/0603/1%  [tro smd 0603]
R89  1003/0603/1%  [tro smd 0603]
R90  1002/0603/1%  [tro smd 0603]
R91  1001/0603/1%  [tro smd 0603]
R92  1002/0603/1%  [tro smd 0603]
R93  1003/0603/1%  [tro smd 0603]
R100  2702/0603/1%  [tro smd 0603]
R101  105/0603/1%  [tro smd 0603]  (value not drawn)
R102  2702/0603/1%  [tro smd 0603]
R103  105/0603/1%  [tro smd 0603]  (value not drawn)
R104  2702/0603/1%  [tro smd 0603]
R105  105/0603/1%  [tro smd 0603]  (value not drawn)
R106  2702/0603/1%  [tro smd 0603]
R107  105/0603/1%  [tro smd 0603]  (value not drawn)
R108  1001/0805/1%  [tro smd 0805]
R109  1001/0603/1%  [tro smd 0603]
R110  1002/0603/1%  [tro smd 0603]
R111  1002/0603/1%  [tro smd 0603]
R112  1002/0603/1%  [tro smd 0603]
R113  1001/0603/1%  [tro smd 0603]
R114  1002/0603/1%  [tro smd 0603]
R115  153/2010/1%  [tro smd 0603]
R116  153/2010/1%  [tro smd 0603]
R117  153/2010/1%  [tro smd 0603]
R118  153/2010/1%  [tro smd 0603]
R119  153/2010/1%  [tro smd 0603]
R120  153/2010/1%  [tro smd 0603]
R121  2702/0805/1%  [tro smd 0805]
R122  2702/0805/1%  [tro smd 0805]
R123  1001/0603/1%  [tro smd 0603]
R124  2701/0805/1%  [tro smd 0805]
R125  470R/0603/1%  [tro smd 0603]
R126  470R/0603/1%  [tro smd 0603]
R127  470R/0603/1%  [tro smd 0603]
R128  1001/0603/1%  [tro smd 0603]
R129  1001/0603/1%  [tro smd 0603]
R130  1001/0603/1%  [tro smd 0603]
R131  4702/0603/1%  [tro smd 0603]
R132  4702/0603/1%  [tro smd 0603]
R133  4702/0603/1%  [tro smd 0603]
R134  4702/0603/1%  [tro smd 0603]
R135  4702/0603/1%  [tro smd 0603]
R136  4702/0603/1%  [tro smd 0603]
R137  1002/0603/1%  [tro smd 0603]
R138  1002/0603/1%  [tro smd 0603]
R139  1002/0603/1%  [tro smd 0603]
R140  1001/0603/1%  [tro smd 0603]
R141  1001/0603/1%  [tro smd 0603]
R142  1001/0603/1%  [tro smd 0603]
R143  1002/0603/1%  [tro smd 0603]
R144  1002/0603/1%  [tro smd 0603]
R145  1002/0603/1%  [tro smd 0603]
R146  1001/0603/1%  [tro smd 0603]
R147  1001/0603/1%  [tro smd 0603]
R148  1001/0603/1%  [tro smd 0603]
R150  3901/0603/1%  [tro smd 0603]
R151  1001/0603/1%  [tro smd 0603]
R152  1001/0603/1%  [tro smd 0603]
R153  5101/0603/1%  [tro smd 0603]
R154  3901/0603/1%  [tro smd 0603]
R155  1001/0603/1%  [tro smd 0603]
R156  5101/0603/1%  [tro smd 0603]
R157  1001/0603/1%  [tro smd 0603]
R158  1001/0603/1%  [tro smd 0603]
R159  1001/0603/1%  [tro smd 0603]
R160  1001/0603/1%  [tro smd 0603]
R161  0R0/0603  [tro smd 0603]
R162  1002/0603/1%  [tro smd 0603]
R163  1001/0603/1%  [tro smd 0603]
R164  1002/0603/1%  [tro smd 0603]
R165  2001/0603/0.5%  [tro smd 0603]
R166  620R/0603/0.5%  [tro smd 0603]
R167  0R/0603  [tro smd 0603]
R168  0R/0603  [tro smd 0603]
R169  0R/0603  [tro smd 0603]
R170  1002/0603/1%  [tro smd 0603]
R171  0R/0603  [tro smd 0603]
R172  22R0/0603/0.5%  [tro smd 0603]
R173  22R0/0603/0.5%  [tro smd 0603]
R174  22R0/0603/0.5%  [tro smd 0603]
R?  1002/0603/1%  [tro smd 0603]
RV1  S14K60  [S14K60]
T1  2.8mH  [EE13/7/4-Vertical/(EF12.6)]  (value not drawn)
T2  2.8mH  [EE13/7/4-Vertical/(EF12.6)]  (value not drawn)
T3  Trans CT  [TRF_5]
T4  Trans Ideal  [TRF_4]
T5  2.8mH  [EE13/7/4-Vertical/(EF12.6)]  (value not drawn)
T6  2.8mH  [EE13/7/4-Vertical/(EF12.6)]  (value not drawn)
U1  GD32F303RGT6  [QFP50P1200X1200X160-64N]
U2  ISO1050DUB  [SOP254P1040X485-8N]
U3  MC79L05ACDR2G  [SOIC127P600X175-8N]
U5  AMS1117-5V  [SOT223]
U7  LTV-816S  [SOP254P1016X400-4N]
U8  UC3845BD1G  [SOIC127P600X175-8N]
U9  AMS1117-3.3V  [SOT223]
U10  ISO7221CD  [SOIC127P600X175-8N]
U11  SN75176AD  [SOIC127P600X175-8N]
U12  LTV-816S  [SOP254P1016X400-4N]
U13  W25Q16JVSSIQ  [SOIC127P790X216-8N]
U14  DS1340Z-3+  [SOIC127P600X175-8N]
U15  MC33172DR2GH  [SOIC127P600X175-8N]
U16  MC33172DR2GH  [SOIC127P600X175-8N]
U17  INA826AIDGKR  [SOP65P490X110-8N]
U18  AMS1117-3V  [SOT223]
U19  MC33172DR2GH  [SOIC127P600X175-8N]
U20  MC33172DR2GH  [SOIC127P600X175-8N]
U22  NCP5663DSADJR4G  [NCP5663DSADJR4G]
U23  SIM-ST-MFF2  [PSON127P500X600X82-9N]
U24  MPU-C792-3  [GCT_SIM7200-6-0-18-00-X_REVA]
U25  SZNUP4114HMR6T1G  [SOP95P275X110-6N]
U26  SZNUP4114HMR6T1G  [SOP95P275X110-6N]
X3  32.768KHz  [Thach Anh 2 chan cam]
Y1  8Mhz  [Thach Anh 2 chan cam]
Y2  32.768KHz  [Thach Anh 2 chan cam]
Z1  MU2029-151Y  [tro smd 0603]
Z2  MU2029-151Y  [tro smd 0603]
Z3  MU2029-151Y  [tro smd 0603]
Z4  MU2029-151Y  [tro smd 0603]
Z8  MU2029-151Y  [tro smd 0603]
Z9  MU2029-151Y  [tro smd 0603]
Z10  MU2029-151Y  [tro smd 0603]
Z14  MU2029-151Y  [tro smd 0603]
Z15  MU2029-151Y  [tro smd 0603]
Z20  MU2029-151Y  [tro smd 0603]
Z21  MU2029-151Y  [tro smd 0603]
Z22  MU2029-151Y  [tro smd 0603]
Z23  MU2029-151Y  [tro smd 0603]
Z30  MU2029-151Y  [tro smd 0603]
Z31  MU2029-151Y  [tro smd 0603]
Z32  MU2029-151Y  [tro smd 0603]
Z33  MU2029-151Y  [tro smd 0603]
Z34  MU2029-151Y  [tro smd 0603]
Z35  MU2029-151Y  [tro smd 0603]

## Nets
3V3_MCU: C01.1 C02.1 C03.1 C04.1 C05.1 C06.1 C8.1 C10.1 C13.2 C15.2 C73.1 C74.1 C75.1 C76.1 D3.2 D30.2 D31.2 D32.2 D36.2 D38.2 D50.2 J9.4 J13.1 J13.2 LED3.1(A) LED4.1(A) LED5.1(A) Q3.2(C) R8.2 R75.1 R76.1 R137.2 R138.2 R139.2 R143.2 R144.2 R145.2 R161.2 R?.2 U1.1(VBAT) U1.9(PC1) U1.18(VSS_4) U1.32(VDD_1) U1.48(VDD_2) U1.64(VDD_3) U2.1(VCC1) U9.2(VOUT) U9.4(VOUT) U10.1(VCC1) U13.8(VCC)
+3.3V_MAIN: C77.1 U14.8(VCC)
+3.3V_TEMP: C155.1 R150.2 R154.2 R158.2 R161.1
+5_MAIN: C112.1 C113.1 U18.3(VIN)
+5V_CAN_1: C14.2 C16.2 C18.2 C61.1 C62.1 R17.1 R70.2 T5.3 U2.8(VCC2) U10.8(VCC2) U11.8(VCC)
+5V_FB: C36.1 C37.1 C38.1 C39.1 C40.1 D13.2(K) L2.1 R28.1 R46.1
+5V_MAIN: BZ1.1 C41.1 C46.2 C71.1 C72.1 C86.1 C89.1 C97.1 C99.1 C101.1 C102.1 C160.1 C161.1 C162.1 D2.K D33.2 D34.2 L2.2 R7.2 R12.1 R162.2 U9.3(VIN) U15.8(VCC) U16.8(VCC) U17.8(+VS) U19.8(VCC) U20.8(VCC) U22.2(VIN)
-5V_ANALOG: C44.2 C45.2 C47.2 C82.2 C85.2 C96.1 C98.1 C104.1 C105.1 D33.1 D34.1 U3.1(VOUT) U15.4(VEE) U16.4(VEE) U17.5(-VS) U19.4(VEE) U20.4(VEE)
GND: B1.7(7B) B1.8(E) C1.2 C01.2 C2.2 C02.2 C3.2 C03.2 C4.2 C04.2 C5.1 C05.2 C6.2 C06.2 C7.2 C8.2 C9.2 C10.2 C11.1 C12.1 C13.1 C15.1 C17.1 C19.2 C20.2 C22.2 C23.2 C24.2 C25.2 C26.1 C26.2 C27.2 C28.2 C29.2 C30.2 C31.2 C34.2 C36.2 C37.2 C38.2 C39.2 C40.2 C41.2 C42.1 C44.1 C45.1 C46.1 C47.1 C58.2 C60.2 C63.2 C64.2 C68.2 C69.2 C70.2 C71.2 C72.2 C73.2 C74.2 C75.2 C76.2 C77.2 C78.2 C80.2 C82.1 C83.1 C84.2 C85.1 C86.2 C88.1 C89.2 C90.1 C91.1 C92.1 C93.1 C96.2 C97.2 C98.2 C99.2 C100.2 C101.2 C102.2 C103.2 C104.2 C105.2 C107.2 C108.2 C109.2 C110.2 C111.2 C112.2 C113.2 C114.2 C115.2 C116.1 C117.2 C131.1 C132.1 C133.1 C134.1 C135.1 C136.1 C137.2 C138.2 C139.2 C140.2 C141.2 C142.2 C150.1 C151.1 C152.1 C153.1 C154.2 C155.2 C160.2 C161.2 C162.2 C163.2 C164.2 D3.1 D11.1 D11.2 D20.A D22.A D26.A D27.A D28.A D29.A D30.1 D31.1 D32.1 D36.1 D37.3 D38.1 D39.3 D50.1 J1.7 J1.8 J9.2 J13.3 J13.4 LED1.2(K) Q1.1(E) Q2.1(E) Q11.1(E) Q12.1(E) Q17.1(E) Q18.1(E) Q19.1(E) Q25.1(E) R4.1 R6.1 R23.1 R24.1 R33.1 R35.1 R47.2 R88.2 R93.2 R101.1 R103.1 R105.1 R107.1 R124.1 R153.2 R156.2 R159.1 R164.1 R166.2 T2.4 T3.4(SecCT) U1.12(VSSA) U1.19(VDD_4) U1.31(VSS_1) U1.47(VSS_2) U1.63(VSS_3) U2.4(GND1) U3.5(GND) U7.3(EMITTER) U8.2(VOLTAGE_FEEDBACK) U8.5(GND) U9.1(GND) U10.4(GND1) U12.2(K) U13.4(GND) U14.4(GND) U17.6(REF) U18.1(GND) U22.3(GROUND_1) U22.6(GROUND_2)  [also labelled REF_6]
GND_CAN_1: C14.1 C16.1 C18.1 C61.2 C62.2 D4.3 D5.3 R14.2 R72.1 T5.4 U2.5(GND2) U10.5(GND2) U11.5(GND) U12.3(EMITTER)
GND_P: C48.2 C49.2 T4.2(Pri-)
REF_OUT: C6.1 C9.1 C103.1 C114.1 C115.1 R84.1 R92.1 R112.1 U1.13(VDDA) U18.2(VOUT) U18.4(VOUT)
USIM_GND: C165.1 C166.2 C167.1 C168.1 C169.2 C170.1 C171.1 C172.2 J12.5 U23.1(GND) U23.9(EPAD) U24.C5(GND) U25.2(GND) U26.2(GND)
USIM_VDD: C166.1 J12.1 R170.2 R171.2 U24.C1(VCC) U25.5(VCC) U26.5(VCC)
VCCS1: C48.1 C49.1 D15.2(K) R30.2 R48.1
VIN: C28.1 C29.1 C30.1 C33.1 C34.1 L1.2 R27.2 R39.2 R40.2 R49.2 T3.1(Pri+)
VOUT: C163.1 C164.1 J13.5 J13.6 R165.2 U22.4(VOUT)  [also labelled +3.8V_MAIN]
VREF_U202: C68.1 D19.2 R41.2 R42.1 R51.2 U8.8(VREF)
+48V_MEA: J1.1 J1.2 J1.11 R20.1 RV1.1 Z10.1
-48V_POW: D10.2(K) J1.3 J1.4
ADJ: R165.1 R166.1 U22.5(ADJ)
B1: B1.1(1B) C131.2 D40.A
B2: B1.2(2B) C132.2 D41.A
B3: B1.3(3B) C133.2 D42.A
B4: B1.4(4B) C134.2 D43.A
B5: B1.5(5B) C135.2 D44.A
B6: B1.6(6B) C136.2 D45.A
BAT_FUSE_1_AMP: C83.2 D31.3 R85.1 U1.25(PC5)
BAT_FUSE_1N: C91.2 D28.K R81.2 R102.2 R103.2
BAT_FUSE_1P: C90.2 D29.K R80.2 R100.2 R101.2
BAT_FUSE_2_AMP: C88.2 D30.3 R91.1 U1.26(PB0)
BAT_FUSE_2N: C93.2 D26.K R87.2 R106.2 R107.2
BAT_FUSE_2P: C92.2 D27.K R86.2 R104.2 R105.2
BAT_FUSE_IN1: J1.21 Z20.1
BAT_FUSE_IN2: J1.19 Z21.1
BAT_FUSE_IN3: J1.23 Z22.1
BAT_FUSE_IN4: J1.25 Z23.1
BATT_CURR: C107.1 R113.2 U1.27(PB1)
BUZZ: R3.1 U1.53(PC12)
CAN_RX_MCU: C11.2 R10.2 U1.44(PA11)
CAN_TX_MCU: R11.2 U1.45(PA12)
CANH_REC: J1.17 Z3.2
CANL_REC: J1.15 Z4.2
CLK: C171.2 R173.2 U24.C3(CLK) U26.1(I/01)
CLK_E: C168.2 R168.2 U23.6(CLK) U25.1(I/01)
COMPEN: D18.1 D18.2 D19.1 R42.2 U7.4(COLLECTOR) U8.1(COMPENSATION)
CONTROL_FAN: R5.1 U1.15(PA1)
CS_N: C95.2 C110.1 D34.3 R115.1 R116.1 R117.1 U17.4(+IN)
CS_P: C95.1 C109.1 D33.3 R118.1 R119.1 R120.1 U17.1(-IN)
CURR_IN_N: J1.27 Z8.1
CURR_IN_P: J1.29 Z9.1
CURRENT: C31.1 R22.1 U8.3(CURRENT_SENSE)
D1: U10.6(OUTB) U11.4(D)
DI_1: B1.16(1C) R143.1 R146.1
DI_1_MCU: C140.1 R146.2 U1.21(PA5)
DI_2: B1.15(2C) R144.1 R147.1
DI_2_MCU: C141.1 R147.2 U1.20(PA4)
DI_3: B1.14(3C) R145.1 R148.1
DI_3_MCU: C142.1 R148.2 U1.17(PA3)
DI_4: B1.13(4C) R137.1 R140.1
DI_4_MCU: C137.1 R140.2 U1.16(PA2)
DI_5: B1.12(5C) R138.1 R141.1
DI_5_MCU: C138.1 R141.2 U1.11(PC3)
DI_6: B1.11(6C) R139.1 R142.1
DI_6_MCU: C139.1 R142.2 U1.10(PC2)
DI_IN1: J1.12 Z30.1
DI_IN2: J1.14 Z31.1
DI_IN3: J1.16 Z32.1
DI_IN4: J1.18 Z33.1
DI_IN5: J1.20 Z34.1
DI_IN6: J1.22 Z35.1
ENABLE: Q25.2(C) R162.1 U22.1(ENABLE)
FAN_CONTROL: J1.9 Q2.2(C) R7.1
FAN_SENSE: C5.2 D3.3 R9.2 U1.14(PA0-WKUP)
I/O: C170.2 R172.2 U24.C7(I/O) U26.3(I/O3)
I/O_E: C167.2 R169.2 R170.1 U23.3(I/O) U25.3(I/O3)
LED: R2.1 U1.30(PB11)
LED_GREEN_MCU: R130.1 U1.54(PD2)
LED_RED_MCU: R129.1 U1.56(PB4)
LED_YELLOW_MCU: R128.1 U1.55(PB3)
MCU_DIR_485: R73.2 U1.50(PA15)
MCU_RX_485: C19.1 R16.2 U1.52(PC11)
MCU_TX_485: R15.2 U1.51(PC10)
NEG_IN_1: R110.1 U20.1(OUT_1) U20.2(NEG_IN_1)
NRST_MCU: C7.1 R?.1 U1.7(NRST)
OSC32IN: C3.1 U1.3(PC14-OSC32IN) Y2.2
OSC32OUT: C4.1 U1.4(PC15-OSC32OUT) Y2.1
OSCIN: C1.1 R1.1 U1.5(PD0-OSCIN) Y1.2
OSCOUT: C2.1 R1.2 U1.6(PD1-OSCOUT) Y1.1
OUTPUT: D11.3 R21.1 U8.6(OUTPUT)
POWER_ON/OFF_3G: R163.1 U1.59(PB7)
R1: U10.7(INA) U11.1(R)
RESET: C172.1 R174.2 U24.C2(RST) U26.6(I/O2)
RESET_E: C169.1 R167.2 U23.7(RST) U25.6(I/O2)
RESET_MODULE: J10.4 J11.4 U1.58(PB6)
RI_MCU: J10.1 U1.57(PB5)
RS485_A: D5.2 D6.2 J2.1 R18.2 R70.1 R71.1
RS485_B: D5.1 D6.1 J2.2 R19.2 R71.2 R72.2
RX_MCU: J10.3 J11.1 U1.43(PA10)
SCL: U1.61(PB8) U14.6(SCL)
SDA: U1.62(PB9) U14.5(SDA)
SPEED_FAN: J1.10 R8.1 R9.1
SPI_CLK: U1.34(PB13) U13.6(CLK)
SPI_CS_FLASH: U1.38(PC7) U13.1(/CS)
SPI_MISO: U1.35(PB14) U13.2(DO_(IO1))
SPI_MOSI: U1.36(PB15) U13.5(DI_(IO0))
SPI_WP: R75.2 U1.37(PC6) U13.3(IO2)
TCLK_CLK: J9.3 U1.49(PA14)
TEMP1_N: D39.1 J1.26 Z14.1
TEMP1_P: D39.2 J1.24 R150.1
TEMP2_N: D37.1 J1.30 Z15.1
TEMP2_P: D37.2 J1.28 R154.1
TEMP_1: C151.2 D38.3 R152.2 U1.23(PA7)
TEMP_2: C153.2 D36.3 R155.2 U1.24(PC4)
TMS_DIO: J9.1 U1.46(PA13)
TX_MCU: J10.2 J11.2 U1.42(PA9)
USIM_CLK: J12.3 R168.1 R173.1
USIM_DATA: J12.2 R169.1 R172.1
USIM_RST: J12.4 R167.1 R174.1
V_BAT: C117.1 D50.3 R123.1
VCC_TEMP_VDC: C154.1 R160.2 U1.22(PA6)
NetBZ1_2: BZ1.2 D2.A Q1.2(C)
NetC12_2: C12.2 R11.1 U2.3(TXD)
NetC17_2: C17.2 R15.1 U10.3(INB)
NetC20_1: C20.1 R20.2 T1.1
NetC21_1: C21.1 C25.1 T1.3 T2.1
NetC21_2: C21.2 C24.1 T1.4 T2.6
NetC22_1: C22.1 C27.1 L1.1 T2.3
NetC23_1: C23.1 F1.2 RV1.2 T1.6
NetC32_1: C32.1 D12.1(A) Q10.2(D) T3.2(Pri-)
NetC32_2: C32.2 R25.2 R26.2
NetC33_2: C33.2 D12.2(K) R27.1
NetC35_1: C35.1 D13.1(A) T3.3(Sec+)
NetC35_2: C35.2 R28.2
NetC42_2: C42.2 D14.1(A) R29.1 U3.2(VIN_1) U3.3(VIN_2) U3.6(VIN_3) U3.7(VIN_4)
NetC43_1: C43.1 D14.2(K) T3.5(Sec-)
NetC43_2: C43.2 R29.2
NetC50_1: C50.1 R30.1
NetC50_2: C50.2 D15.1(A) T4.1(Pri+)
NetC51_1: C51.1 D16.1(A) T4.3(Sec+)
NetC51_2: C51.2 R31.2
NetC52_1: C52.1 D16.2(K) L3.1 R31.1
NetC52_2: C52.2 C53.2 C54.2 C55.2 C56.2 T4.4(Sec-) U5.1(GND) Z2.1
NetC53_1: C53.1 C54.1 L3.2 U5.3(VIN)
NetC55_1: C55.1 C56.1 U5.2(VOUT) U5.4(VOUT) Z1.1
NetC57_1: C57.1 R32.2 R34.1 T5.6 Z2.2
NetC57_2: C57.2 C58.1
NetC59_1: C59.1 R34.2 T5.1 Z1.2
NetC59_2: C59.2 C60.1
NetC63_1: C63.1 D17.1(A) Q11.3(B) R35.2
NetC64_1: C64.1 D19.3 R41.1
NetC65_1: C65.1 R45.2
NetC65_2: C65.2 C66.2 C67.2 D20.REF R47.1
NetC66_1: C66.1 D20.K R44.2 R45.1 U7.2(K)
NetC67_1: C67.1 R43.1 R46.2
NetC69_1: C69.1 D22.K R48.2 R50.1 U8.7(VCC)
NetC70_1: C70.1 R51.1 U8.4(RT/CT)
NetC78_1: C78.1 U14.3(VBACKUP)
NetC80_1: C80.1 R81.1 R93.1 U15.3(POS_IN_1)
NetC81_1: C81.1 R82.1 R83.1 U15.1(OUT_1)
NetC81_2: C81.2 R80.1 R82.2 U15.2(NEG_IN_1)
NetC84_1: C84.1 R87.1 R88.1 U16.3(POS_IN_1)
NetC87_1: C87.1 R89.1 R90.1 U16.1(OUT_1)
NetC87_2: C87.2 R86.1 R89.2 U16.2(NEG_IN_1)
NetC100_1: C100.1 R109.2 U20.3(POS_IN_1)
NetC106_1: C106.1 R110.2 R111.1 R112.2
NetC108_1: C108.1 R114.1 R118.2 R119.2 R120.2 Z9.2
NetC111_1: C111.1 R114.2 R115.2 R116.2 R117.2 Z8.2
NetC116_2: C116.2 R122.2 R123.2 R124.2
NetC150_2: C150.2 R151.2 R152.1
NetC152_2: C152.2 R155.1 R157.2
NetC165_2: C165.2 R171.1 U23.8(VCC)
NetD4_1: D4.1 R14.1 T6.4 Z4.1
NetD4_2: D4.2 R12.2 R13.1 T6.3 Z3.1
NetD10_1: D10.1(A) F1.1
NetD17_2: D17.2(K) R37.2 R38.2 R39.1
NetD18_3: D18.3 Q12.2(C) R37.1 R38.1
NetD40_K: D40.K R131.2
NetD41_K: D41.K R132.2
NetD42_K: D42.K R133.2
NetD43_K: D43.K R134.2
NetD44_K: D44.K R135.2
NetD45_K: D45.K R136.2
NetLED1_1: LED1.1(A) R2.2
NetLED3_2: LED3.2(K) R125.1
NetLED4_2: LED4.2(K) R126.1
NetLED5_2: LED5.2(K) R127.1
NetQ1_3: Q1.3(B) R3.2 R4.2
NetQ2_3: Q2.3(B) R5.2 R6.2
NetQ3_1: Q3.1(E) R74.2
NetQ3_3: Q3.3(B) R73.1
NetQ10_1: Q10.1(G) R21.2
NetQ10_3: Q10.3(S) R22.2 R23.2 R24.2 R25.1 R26.1
NetQ11_2: Q11.2(C) Q12.3(B) R36.2
NetQ17_2: Q17.2(C) R125.2
NetQ17_3: Q17.3(B) R128.2
NetQ18_2: Q18.2(C) R126.2
NetQ18_3: Q18.3(B) R129.2
NetQ19_2: Q19.2(C) R127.2
NetQ19_3: Q19.3(B) R130.2
NetQ25_3: Q25.3(B) R163.2 R164.2
NetR10_1: R10.1 U2.2(RXD)
NetR16_1: R16.1 U10.2(OUTA)
NetR17_2: R17.2 U11.2(~{RE}) U11.3(DE) U12.4(COLLECTOR)
NetR18_1: R18.1 U11.7(B)
NetR19_1: R19.1 U11.6(A)
NetR32_1: R32.1 R33.2
NetR36_1: R36.1 R40.1
NetR43_2: R43.2 R44.1 U7.1(A)
NetR49_1: R49.1 R50.2
NetR74_1: R74.1 U12.1(A)
NetR76_2: R76.2 U13.7(IO3)
NetR83_2: R83.2 R84.2 R85.2
NetR90_2: R90.2 R91.2 R92.2
NetR100_1: R100.1 Z20.2
NetR102_1: R102.1 Z21.2
NetR104_1: R104.1 Z22.2
NetR106_1: R106.1 Z23.2
NetR108_1: R108.1 U17.3(RG_2)
NetR108_2: R108.2 U17.2(RG_1)
NetR109_1: R109.1 U17.7(VOUT)
NetR111_2: R111.2 U19.5(POS_IN_2)
NetR113_1: R113.1 U19.6(NEG_IN_2) U19.7(OUT_2)
NetR121_1: R121.1 Z10.2
NetR121_2: R121.2 R122.1
NetR131_1: R131.1 Z30.2
NetR132_1: R132.1 Z31.2
NetR133_1: R133.1 Z32.2
NetR134_1: R134.1 Z33.2
NetR135_1: R135.1 Z34.2
NetR136_1: R136.1 Z35.2
NetR151_1: R151.1 R153.1 Z14.2
NetR156_1: R156.1 R157.1 Z15.2
NetR158_1: R158.1 R159.2 R160.1
NetT6_1: T6.1 U2.7(CANH)
NetT6_6: T6.6 U2.6(CANL)
NetU14_1: U14.1(X1) X3.2
NetU14_2: U14.2(X2) X3.1

Not connected (* = marked no-connect by the designer): B1 9(COM)* 10(7C)*; C106 2; D22 NC(2)*; D26 NC(2)*; D27 NC(2)*; D28 NC(2)*; D29 NC(2)*; D32 3; D40 NC(2)*; D41 NC(2)*; D42 NC(2); D43 NC(2)*; D44 NC(2); D45 NC(2)*; J1 5* 6* 13*; J11 3*; R13 2; U1 2(PC13-TAMPER-RTC)* 8(PC0)* 28(PB2)* 29(PB10)* 33(PB12)* 39(PC8)* 40(PC9)* 41(PA8)* 60(BOOT0)*; U3 4(NC_1)* 8(NC_2)*; U14 7(FT/OUT)*; U15 5(POS_IN_2)* 6(NEG_IN_2)* 7(OUT_2)*; U16 5(POS_IN_2)* 6(NEG_IN_2)* 7(OUT_2)*; U19 1(OUT_1)* 2(NEG_IN_1)* 3(POS_IN_1)*; U20 5(POS_IN_2)* 6(NEG_IN_2)* 7(OUT_2)*; U24 C6(VPP)*; U25 4(I/O4)*; U26 4(I/O4)*

## Notes on the sheet
- THACH ANH 8MHZ
- (near C81) BATFUSE: 02 CH
- Bat_Fuse_IN kết nối với bus 48V
- Chỉ để giám sát xem aptomat đóng hay mở
- LOAD FUSE: 06 CH
- Đọc trạng thái của aptomat tải, giám sát họa động của 6 aptomat
- CONNECTOR
- CENTER CONTROLLER MOLDULE
- OPAMP_1
- (near B1) VÀO
- (near B1) RA
- LED_MCU
- (near C3) THACH ANH 32KHZ
- JUMP1 AND JUMP 4
- OPAMP_2
- led cảnh báo khi có sự cố
- VOLTAG SENSE
- Đo điện áp trên bus tủ nguồn, dải do: 0-68V
- Không hiểu đo điện áp kiểu gì
- (near J9) JUMP 5
- BUZZ_MCU
- FAN_CONTRLLER
- SPEED_FAN
- Điều khiển tốc độ của quạt qua chân Speed_Fan(PWM)
- D3 có tác dụng bảo vệ chân Fan_senser khỏi dòng âm và dòng lớn hơn 3V3
- COMMUNICATION MOLDULE
- SENSER CURRENT
- Đo dòng điện sạc sả ác quy
- Đầu ra của MCU
- Đầu vào điều khiển quạt
- Đầu vào là 2 chân của  MCU và  đầu ra là 2 rắc cắm để kết nối với các thiết bị bên ngoài sử dụng giao tiếp Canbus
- BATT_CURR là dòng điện đo được đưa về MCU
- CURR_IN LÀ ĐẦU VÀO DÒNG ĐIỆN
- Buzz điều khiển đóng mở loa
- (near R4) Diode D2 bảo vệ loa khỏi dòng điện ngược
- (near R6) Control_Fan dùng để điều khiển Fan_Control
- (near R6) Control_Fan = 1   => Fan_control = 0
- (near R6) Control_Fan = 0   => Fan_control = 1
- (near R8) Đầu ra tốc độ quạt
- Đầu vào của  MCU(phản hồi)
- CAN_1
- Speed_Fan = 1   => Fan_senser = 1
- Speed_Fan = 0   => Fan_senser = 0
- (near U18) 5V --> 3.3V
- (near R118) Không hiểu cái này dùng làm gì?
- Đầu vào là 2 chân của  MCU và  đầu ra là 2 rắc cắm để kết nối với các thiết bị bên ngoài sử dụng giao tiếp RS485
- RS485
- AX MODULE
- CALENDAR
- TEMPRATURE
- Không hiểu khối này đo nhiệt độ kiểu gì
- Dùng 6 chân của MCU Temp1 chưa hiểu dùng để làm gì?
- FLASH
- (near C76) Lưu cài đặt tham số từ trước khi khối không được cấp nguồn
- kết nối với MCU qua SPI
- Thu thập dữ liệu theo thời gian thực
- kết nối với MCU qua giao tiếp I2C
- Mạch phân áp thông tin nhiệt độ chuyển về MCU dưới dạng điện áp đưa  vào ADC
- (near R150) TEM1_P là đầu vào nhiệt độ
- Đầu vào MCU
- Từ nguồn 48V thu được điện áp VIN
- (near L1) Có các tụ để lưu trữ năng lượng
- (near L1) Qua các tụ lọc nhiễu và bộ lọc nhiễu LCL thì điện áp DC đầu ra bằng phẳng hơn
- ESIM
- AC_48V
- Hạ áp từ 5V xuống 3V3 cung cấp cho MCU
- 5V --> 3.8V
- Compen: Đầu ra bộ khuếch đại lỗi và sử dụng để  bù vòng lặp
- U8: chuyển đổi DC-DC, Đầu ra phù hợp điều khiển mosfet công suất
- Voltage_feedback: Đầu vào đảo ngược của bộ khuếch đại lỗi, và được nối với nguồn điện qua bộ chia trở
- Current_senser: Đầu vào sử dụng PWM để kết thúc quá trình đẫn dòng của công tắc đầu ra
- Output: Đầu ra trực tiếp nối với mosfet của nguồn, Dòng  lên đến 1A và Chuyển đổi nửa tần số dao động
- Vref: Đây là đầu ra tham chiếu. Nó cung cấp dòng nạp cho tụ CT qua điện trở RT
- RT/CT: Đầu ra tần số dao động tối đa được lập trình lên đến 1KHz
- (near U8) Vcc: Đầu vào cung cấp nguồn  dương cho VĐK
- (near R167) CHIP SIM
- (near R174) CARD MICRO SIM
- Từ Output(U8) cùng với Vin hạ áp xuống còn +5V_FB và +5V_MAIN
- Đồng thời cấp đầu vào cho chân CURRENT
- Bộ này để làm gì?
- CONNECTION
- (near U25) CHIP SIM SP
- (near U26) CAD MICRO SIM SP
- Hạ áp  + lọc nhiễu từ điện áp VSS1 xuống để cấp cho CAN bus là +5V_CAN
- Labels drawn without touching a wire or pin: GND
- (in symbol BAT54C-TP) Text
- (in symbol Tranf5) 120-385V; W1; 3.3-6V ,3W; W2

## Library data of the parts
B1 = ULN2003ADRG3: HIGH-VOLTAGE, HIGH-CURRENT DARLINGTON TRANSISTOR ARRAYS; Manufacturer_Name: Texas Instruments; Geometry.Height: 1.75mm; Manufacturer_Part_Number: ULN2003ADRG3; Mouser Part Number: 595-ULN2003ADRG3; Mouser Price/Stock: https://www.mouser.co.uk/ProductDetail/Texas-Instruments/ULN2003ADRG3?qs=EuM%2FBx4ov4S9cNTsuvFOhA%3D%3D; Arrow Part Number: ULN2003ADRG3; Arrow Price/Stock: https://www.arrow.com/en/products/uln2003adrg3/texas-instruments?region=nac; Mouser Testing Part Number: *; Mouser Testing Price/Stock: *; Datasheet Link: http://www.ti.com/lit/gpn/uln2003a
C1-C4 = Tu 0603 22pF 50V 10%: Dán; Don_Vi: Con; So_Chan: 2; Ten_Linh_Kien: Tụ 0603 22pF 50V 10%; Ma_Hang: MH004570; Chung_Loai: Dán; Kieu_Chan: *
C01 C02 C03 C04 C5 C05 C6 C06-C19 C72-C74 C76 C77 C80-C93 C95-C117 C131-C142 C150-C155 C162 C163 C165-C172 = Tu 0603 104 50V 10%: Dán; Don_Vi: Con; So_Chan: 2; Ten_Linh_Kien: Tụ 0603 104-100nF 10% 50V; Ma_Hang: MH004568; Chung_Loai: Dán; Kieu_Chan: *
C20-C27 C29 C30 C33 C34 = Tu 1206 4.7nF 50V: Dán; Don_Vi: Con; So_Chan: 2; Ten_Linh_Kien: Tụ 1206 4.7nF 50V NPO; Ma_Hang: MH007538; Chung_Loai: Dán; Kieu_Chan: *
C28 = Tu Hoa 47uF 16V 5x10: Cắm; Don_Vi: Con; So_Chan: 2; Ten_Linh_Kien: Tụ Hóa 47uF 16V; Ma_Hang: MH006859; Chung_Loai: Cắm; Kieu_Chan: *
C31 C32 C35 C43 C50 C51 C63 C65-C67 C69 = Tu 0805 20pF 50V 10%: Dán; Don_Vi: Con; Ten_Linh_Kien: Tụ 0805 20P 10% 50V; So_Chan: 2; Ma_Hang: MH004558; Chung_Loai: Dán; Kieu_Chan: *
C36-C42 C44 C45 C48 C49 C52-C56 C61 C62 C64 C68 C70 = Tu 0603 103 50V 10%: Dán; Don_Vi: Con; So_Chan: 2; Ten_Linh_Kien: Tụ 0603 103-10nF 10% 50V; Ma_Hang: MH004567; Chung_Loai: Dán; Kieu_Chan: *
C46 C47 = MKP1837410011: Vishay MKP 1837 100nF Polypropylene Film Capacitor 100 V dc, 63 V ac +/-1%, Through Hole; Geometry.Height: 11mm; Manufacturer_Name: Vishay; Manufacturer_Part_Number: MKP1837410011; Mouser Part Number: 75-MKP1837410011; Mouser Price/Stock: https://www.mouser.co.uk/ProductDetail/Vishay-Roederstein/MKP1837410011?qs=fgoA9hqHNFdbvoDb3kBZqA%3D%3D; Arrow Part Number: MKP1837410011; Arrow Price/Stock: https://www.arrow.com/en/products/mkp1837410011/vishay; Mouser Testing Part Number: *; Mouser Testing Price/Stock: *; Datasheet Link: https://www.vishay.com/docs/26017/mkp1837.pdf
C57-C60 = Tu 1206 22pF 50V 10%: Dán; Ma_Hang: MH004547; Don_Vi: Con; So_Chan: 2; Ten_Linh_Kien: Tụ 1206 22P 10% 50V; Chung_Loai: Dán; Kieu_Chan: *
C71 C75 C160 C161 C164 = Tu tantalum 100uF 6.3V SMD3528: Dán; Don_Vi: Con; So_Chan: 2; Ten_Linh_Kien: Tụ tantalum 107J-100uF 6.3V SMD3528; Ma_Hang: MH007595; Chung_Loai: Dán; Kieu_Chan: *
C78 = CP9: Cap 10000uF/63V; Value: 220uF/450V
D2 = Diode  1N4007: Diode 1A; Value: 1N4007
D3 D19 D30-D34 D36 D38 D50 = BAT54SLT1G: RLBAT54SLT1G ON Semiconductor BAT54SLT1G Rectifier Diode, 0.2A, 30V, 3-Pin SOT-23; Manufacturer_Name: onsemi; Geometry.Height: 1.11mm; Manufacturer_Part_Number: BAT54SLT1G; Mouser Part Number: 863-BAT54SLT1G; Mouser Price/Stock: https://www.mouser.co.uk/ProductDetail/onsemi/BAT54SLT1G?qs=vLkC5FC1VN9oCh8qaBIZiQ%3D%3D; Arrow Part Number: BAT54SLT1G; Arrow Price/Stock: https://www.arrow.com/en/products/bat54slt1g/on-semiconductor?region=nac; Mouser Testing Part Number: *; Mouser Testing Price/Stock: *; Datasheet Link: http://www.onsemi.com/pub/Collateral/BAT54SLT1-D.PDF
D4 D5 D37 D39 = SM712.TCT: 12V TVS Diode Array, Asymmetrical RS-485 Semtech SM712.TCT, Bi-Directional TVS Diode Array Dual, 26V, 400W, 3-Pin SOT-23; Geometry.Height: 1.12mm; Manufacturer_Name: SEMTECH; Manufacturer_Part_Number: SM712.TCT; Mouser Part Number: 947-SM712.TCT; Mouser Price/Stock: https://www.mouser.co.uk/ProductDetail/Semtech/SM712.TCT?qs=rBWM4%252BvDhIfYU4k7Soov1w%3D%3D; Arrow Part Number: SM712.TCT; Arrow Price/Stock: https://www.arrow.com/en/products/sm712.tct/semtech?region=nac; Mouser Testing Part Number: *; Mouser Testing Price/Stock: *; Datasheet Link: https://datasheet.datasheetarchive.com/originals/distributors/Datasheets-30/DSA-588511.pdf; Supplier 1: RSComponents
D6 = SMAJ10CA: ESD Suppressors / TVS Diodes 400W 10V 5% Bi-Directional ESD Suppressors / TVS Diodes 400W 60V 5% Bi-Directional; Manufacturer_Name: LITTELFUSE; Geometry.Height: 2.29mm; Manufacturer_Part_Number: SMAJ10CA; Mouser Part Number: 576-SMAJ10CA; Mouser Price/Stock: https://www.mouser.co.uk/ProductDetail/Littelfuse/SMAJ10CA?qs=HR2RnyOI4E6vSKXNVUMgrg%3D%3D; Arrow Part Number: SMAJ10CA; Arrow Price/Stock: https://www.arrow.com/en/products/smaj10ca/littelfuse; Mouser Testing Part Number: *; Mouser Testing Price/Stock: *; Datasheet Link: https://docs.rs-online.com/73d0/0900766b81627558.pdf
D10 = D5A: Diode 5A; Value: 1N5408
D11 D18 = BAT54C-TP: Schottky Diodes & Rectifiers 30V 200mA 0.6A 200mW 2.0uA 10pF; Manufacturer_Name: Micro Commercial Components (MCC); Geometry.Height: 1.25mm; Manufacturer_Part_Number: BAT54C-TP; Mouser Part Number: 833-BAT54C-TP; Mouser Price/Stock: https://www.mouser.co.uk/ProductDetail/Micro-Commercial-Components-MCC/BAT54C-TP?qs=Oupk%2FUD005h8nOSuGI2Fmw%3D%3D; Arrow Part Number: BAT54C-TP; Arrow Price/Stock: https://www.arrow.com/en/products/bat54c-tp/micro-commercial-components?region=europe; Mouser Testing Part Number: *; Mouser Testing Price/Stock: *; Datasheet Link: https://www.mccsemi.com/pdf/Products/BAT54-BAT54S(SOT-23).pdf
D12-D16 = Diode 1N4148: Cắm; Ten_Linh_Kien: Diode 1N4148 DO35 450mA 100V ( 1N4148 DIP); Don_Vi: Con; Ma_Hang: MH001065; Ghi Chu: *; Kieu_Chan: *; Chung_Loai: Cắm
D17 = Diode 1N4007: Cắm; Ten_Linh_Kien: Diode 1N4007 1A (DIP); Don_Vi: Con; Ma_Hang: MH001063; Ghi Chu: *; Kieu_Chan: *; Chung_Loai: Cắm
D20 = TL432BIDBZR: Adjustable Precision Shunt Regulator; Manufacturer_Name: Texas Instruments; Geometry.Height: 1.12mm; Manufacturer_Part_Number: TL432BIDBZR; Mouser Part Number: 595-TL432BIDBZR; Mouser Price/Stock: https://www.mouser.com/Search/Refine.aspx?Keyword=595-TL432BIDBZR; Arrow Part Number: TL432BIDBZR; Arrow Price/Stock: https://www.arrow.com/en/products/tl432bidbzr/texas-instruments; Mouser Testing Part Number: *; Mouser Testing Price/Stock: *; Datasheet Link: https://datasheet.datasheetarchive.com/originals/distributors/Datasheets-SFU2/DSASFU100034171.pdf
D22 D26-D29 D40-D45 = BZX84C3V0: 350mW SURFACE MOUNT ZENER DIODE; Package: None; Price: None; Value: *; MP: BZX84C3V0; Availability: Unavailable
F1 = Cau chi 0.5A 125V SMD1808: Ma_Hang: MH009241; Ten: Cầu Chì 0.5A 125V SMD1808 0451.500MRL
J1 = Header 15X2: Header, 15-Pin, Dual row; LatestRevisionDate: 17-Jul-2002; LatestRevisionNote: Re-released for DXP Platform.; Publisher: Altium Limited
J2 = JP 1x2 2.54 Duc Thang: Cắm; Ten_Linh_Kien: Jump Đơn Đực 2.54MM 1x40P Thẳng 11MM; Don_Vi: Con; Ma_Hang: MH000903; Ghi_Chu: *; Kieu_Chan: *; Chung_Loai: Cắm
J9 = Con4: Connector 4; Value: Connector 4
J10 J11 = JP 1x4 2.54 Duc Thang: Cắm; Ten_Linh_Kien: Jump Đơn Đực 2.54MM 1x40P Thẳng 11MM; Don_Vi: Con; Ma_Hang: MH000903; Ghi_Chu: *; Kieu_Chan: *; Chung_Loai: Cắm
J12 = JP 1x5 2.54 Duc Thang: Cắm; Ten_Linh_Kien: Jump Đơn Đực 2.54MM 1x40P Thẳng 11MM; Don_Vi: Con; Ma_Hang: MH000903; Ghi_Chu: *; Kieu_Chan: *; Chung_Loai: Cắm
J13 = JP 1x6 2.54 Duc Thang: Cắm; Ten_Linh_Kien: Jump Đơn Đực 2.54MM 1x40P Thẳng 11MM; Don_Vi: Con; Ma_Hang: MH000903; Ghi_Chu: *; Kieu_Chan: *; Chung_Loai: Cắm
L1-L3 = CUON CAM 100uH SMD: Dán; Don_Vi: Con; Ma_Hang: MH003999; Ten_Linh_Kien: Cuộn Cảm 100uH 7x7x4MM CD74; Ma_Hang: *; Kieu_Chan: *; Chung_Loai: Dán
LED1 = LED 0805 Cam: Dán; Don_Vi: Con; Ma_Hang: MH002328; Ten_Linh_Kien: LED 0805 Màu Cam ( Orange); Ghi_Chu: *; Kieu_Chan: *; Chung_Loai: Dán
LED3 = LED 3mm Vang: Cắm; Don_Vi: Con; Ma_Hang: MH003893; Ten_Linh_Kien: Led 3MM Phủ Vàng (10c); Ghi_Chu: *; Kieu_Chan: *; Chung_Loai: Cắm
LED4 = LED 3mm Do: Cắm; Don_Vi: Con; Ma_Hang: MH003892; Ten_Linh_Kien: Led 3MM Phủ Đỏ (10c); Ghi_Chu: *; Kieu_Chan: *; Chung_Loai: Cắm
LED5 = LED 3mm Xanh La: Cắm; Don_Vi: Con; Ma_Hang: MH001054; Ten_Linh_Kien: Led 3MM Phủ Xanh (10c); Ghi_Chu: *; Kieu_Chan: *; Chung_Loai: Cắm
Q1-Q3 Q11 Q12 Q17-Q19 Q25 = NPN_ECB: P 600mW, ECB; Value: C1815
Q10 = IRF3709S SMD: N-Channel Power MOSFET
R1 R4 R6 R8 R10-R12 R14-R17 R22 R35-R38 R42-R47 R51 R73-R76 R80-R93 R100-R107 R109-R120 R123 R125-R127 R131-R148 R150-R162 R164 R165 R170 R? Z1-Z4 Z8-Z10 Z14 Z15 Z20-Z23 Z30-Z35 = Tro 0603 1% 10k: Dán; Don_Vi: Con; So_Chan: 2; Ten_Linh_Kien: Trở 0603 1% 10k; Ma_Hang: MH006333; Chung_Loai: Dán; Kieu_Chan: *
R2 R3 R5 R9 R128-R130 R163 = Tro 0603 1% 1k: Dán; So_Chan: 2; Don_Vi: Con; Ten_Linh_Kien: Trở 0603 1% 1k; Ma_Hang: MH006334; Chung_Loai: Dán; Kieu_Chan: *
R7 = Tro 0805 1% 3.3R: Dán; Don_Vi: Con; So_Chan: 2; Ten_Linh_Kien: Trở 0805 1% 3.3R; Ma_Hang: MH006291; Chung_Loai: Dán; Kieu_Chan: *
R13 R71 = Tro 1206 1% 220R: Dán; Ma_Hang: MH005897; Don_Vi: Con; So_Chan: 2; Ten_Linh_Kien: Trở 1206 1% 220R; Chung_Loai: Dán; Kieu_Chan: *
R18 R19 R166-R169 R171-R174 = Tro 0603 1% 0R: Dán; Don_Vi: Con; So_Chan: 2; Ten_Linh_Kien: Trở 0603 1% 0R; Ma_Hang: MH005792; Chung_Loai: Dán; Kieu_Chan: *
R20 = Tro Nhiet NTC 47D-15: Cắm; Don_Vi: Con; So_Chan: 2; Ten_Linh_Kien: Điện Trở Nhiệt NTC 47D-15; Ma_Hang: MH005858; Chung_Loai: Cắm; Kieu_Chan: *
R21 R23-R26 R32-R34 = Tro 1206 1% 1k: Dán; Don_Vi: Con; So_Chan: 2; Ten_Linh_Kien: Trở 1206 1% 1k; Ma_Hang: MH005880; Chung_Loai: Dán; Kieu_Chan: *
R27 = Tro 2010 5% 1k: Dán; Don_Vi: Con; So_Chan: 2; Ten_Linh_Kien: Trở 2010 5% 102-1k; Ma_Hang: MH003434; Chung_Loai: Dán; Kieu_Chan: *
R28-R31 R39-R41 R49 R50 = Tro 0805 1% 0.22R: Dán; Don_Vi: Con; So_Chan: 2; Ten_Linh_Kien: Trở 0805 1% 0.22R; Ma_Hang: MH005466; Chung_Loai: Dán; Kieu_Chan: *
R48 = Tro 1206 1% 1M: Dán; Don_Vi: Con; So_Chan: 2; Ten_Linh_Kien: Trở 1206 1% 1M; Ma_Hang: MH005881; Chung_Loai: Dán; Kieu_Chan: *
R70 R72 = Tro 0805 5% 47R: Dán; Don_Vi: Con; So_Chan: 2; Ten_Linh_Kien: Trở 0805 5% 47R; Ma_Hang: MH005321; Chung_Loai: Dán; Kieu_Chan: *
R108 R121 R122 R124 = Tro 0805 5% 1.2k: Dán; Don_Vi: Con; So_Chan: 2; Ten_Linh_Kien: Trở 0805 5% 1.2k; Ma_Hang: MH005231; Chung_Loai: Dán; Kieu_Chan: *
RV1 = S14K60: Varistors 60 VAC  17J 165V-CL   4500A-PK; Manufacturer_Name: TDK; Geometry.Height: 18.5mm; Manufacturer_Part_Number: S14K60; Mouser Part Number: *; Mouser Price/Stock: *; Arrow Part Number: *; Arrow Price/Stock: *; Mouser Testing Part Number: *; Mouser Testing Price/Stock: *; Datasheet Link: https://www.tdk-electronics.tdk.com/inf/70/db/var/SIOV_Leaded_StandarD.pdf?ref_disty=digikey
T1 T2 T5 T6 = Tranf5: Off-Line Transformer WE-UNIT , L=2.8mH; PartNo: 749118105; Manufacturer: Würth Elektronik eiSos GmbH; Turns Ratio: 18.9:1; Input Votage (AC): 85-265; Output voltage (DC): 5; Output Current (A): 0.6; Inductance: 2.8mH; ComponentLink1Description: Manufacturer; ComponentLink1URL: http://www.we-online.de; Created by: Otto Christin; Created Date: OCT 2013; ComponentLink2Description: Datasheet; ComponentLink2URL: http://www.we-online.de/katalog/media/pdf/749118105.pdf
T3 = Trans CT: Center-Tapped Transformer (Coupled Inductor Model); Published: 8-Jun-2000; LatestRevisionDate: 17-Jul-2002; LatestRevisionNote: Re-released for DXP Platform.; PackageReference: TRF_5; Publisher: Altium Limited; PackageDescription: Transformer; 5 Leads
T4 = Trans Ideal: Transformer (Ideal); Published: 8-Jun-2000; LatestRevisionDate: 17-Jul-2002; LatestRevisionNote: Re-released for DXP Platform.; PackageReference: TRF_4; Publisher: Altium Limited; PackageDescription: Transformer; 4 Leads
U1 = GD32F303RGT6: ARM Cortex-M4 32-bit MCU; Manufacturer_Name: GigaDevice Semiconductor (HK) Limited; Geometry.Height: 1.6mm; Manufacturer_Part_Number: GD32F303RGT6; Mouser Part Number: N/A; Mouser Price/Stock: https://www.mouser.co.uk/ProductDetail/GigaDevice/GD32F303RGT6?qs=A6eO%252BMLsxmRbzSGlFw6W%252BQ%3D%3D; Arrow Part Number: *; Arrow Price/Stock: *; Mouser Testing Part Number: *; Mouser Testing Price/Stock: *; Datasheet Link: https://www.gigadevice.com/datasheet/gd32f303xxxx-datasheet/
U2 = ISO1050DUB: CAN Transceiver 1Mbit/s ISO 11898-2 Silent-Mode 8pins SOIC; Manufacturer_Name: Texas Instruments; Geometry.Height: 4.85mm; Manufacturer_Part_Number: ISO1050DUB; Mouser Part Number: 595-ISO1050DUB; Mouser Price/Stock: https://www.mouser.co.uk/ProductDetail/Texas-Instruments/ISO1050DUB?qs=IK5e5L0zOXiBKtns%252BwxBWw%3D%3D; Arrow Part Number: ISO1050DUB; Arrow Price/Stock: https://www.arrow.com/en/products/iso1050dub/texas-instruments?region=nac; Mouser Testing Part Number: *; Mouser Testing Price/Stock: *; Datasheet Link: https://datasheet.datasheetarchive.com/originals/distributors/Datasheets-SFU2/DSASFU100032000.pdf
U3 = MC79L05ACDR2G: Manufacturer_Name: onsemi; Geometry.Height: 1.75mm; Manufacturer_Part_Number: MC79L05ACDR2G; Mouser Part Number: 863-MC79L05ACDR2G; Mouser Price/Stock: https://www.mouser.co.uk/ProductDetail/onsemi/MC79L05ACDR2G?qs=%252B9%2Fcbd0IE0RF56w%2FNOqBRg%3D%3D; Arrow Part Number: MC79L05ACDR2G; Arrow Price/Stock: https://www.arrow.com/en/products/mc79l05acdr2g/on-semiconductor; Mouser Testing Part Number: *; Mouser Testing Price/Stock: *; Datasheet Link: http://www.onsemi.com/pub/Collateral/MC79L00-D.PDF
U5 U9 U18 = AMS1117 SMD: Dán; Value: AMS1117-3.3V SOT223; Don_Vi: Con; Ma_Hang: MH000596; Ghi_Chu: *; Kieu_Chan: *; Chung_Loai: Dán
U7 U12 = LTV-816S: Lite-On LTV-816S DC Input Transistor Output Optocoupler, Surface Mount, 4-Pin PDIP; Geometry.Height: 4mm; Manufacturer_Name: Lite-On; Manufacturer_Part_Number: LTV-816S; Mouser Part Number: 859-LTV-816S; Mouser Price/Stock: https://www.mouser.co.uk/ProductDetail/Lite-On/LTV-816S?qs=XpF7qU%252BvLkW8kf%252BAJLUsYA%3D%3D; Arrow Part Number: LTV-816S; Arrow Price/Stock: https://www.arrow.com/en/products/ltv-816s/lite-on-technology?region=nac; Mouser Testing Part Number: *; Mouser Testing Price/Stock: *; Datasheet Link: https://datasheet.datasheetarchive.com/originals/distributors/Datasheets-305/79781.pdf
U8 = UC3845BD1G: Switching Controllers 52kHz 1A Current PWM w/48% Duty Cycle Max; Manufacturer_Name: onsemi; Geometry.Height: 1.75mm; Manufacturer_Part_Number: UC3845BD1G; Mouser Part Number: 863-UC3845BD1G; Mouser Price/Stock: https://www.mouser.co.uk/ProductDetail/onsemi/UC3845BD1G?qs=xZq1yRCsb1d5dYyiJIRbnw%3D%3D; Arrow Part Number: UC3845BD1G; Arrow Price/Stock: https://www.arrow.com/en/products/uc3845bd1g/on-semiconductor?region=europe; Mouser Testing Part Number: *; Mouser Testing Price/Stock: *; Datasheet Link: https://componentsearchengine.com/Datasheets/2/UC3845BD1G.pdf
U10 = ISO7221CD: Texas Instruments ISO7221CD Digital Isolator SOIC8; Geometry.Height: 1.75mm; Manufacturer_Name: Texas Instruments; Manufacturer_Part_Number: ISO7221CD; Mouser Part Number: 595-ISO7221CD; Mouser Price/Stock: https://www.mouser.co.uk/ProductDetail/Texas-Instruments/ISO7221CD?qs=tP77tliwutCCmPUysEBMTw%3D%3D; Arrow Part Number: ISO7221CD; Arrow Price/Stock: https://www.arrow.com/en/products/iso7221cd/texas-instruments?region=nac; Mouser Testing Part Number: *; Mouser Testing Price/Stock: *; Datasheet Link: http://www.ti.com/lit/ds/symlink/iso7220c.pdf
U11 = SN75176AD: SN75176AD, Line Transceiver, EIA/TIA-422-B, RS-485, RS-422, V.11 10Mbit/s Differential, 5V, 8-Pin SOIC; Manufacturer_Name: Texas Instruments; Geometry.Height: 1.75mm; Manufacturer_Part_Number: SN75176AD; Mouser Part Number: 595-SN75176AD; Mouser Price/Stock: https://www.mouser.co.uk/ProductDetail/Texas-Instruments/SN75176AD?qs=FetendrIl6upbSVFRObzhQ%3D%3D; Arrow Part Number: SN75176AD; Arrow Price/Stock: https://www.arrow.com/en/products/sn75176ad/texas-instruments?region=nac; Mouser Testing Part Number: *; Mouser Testing Price/Stock: *; Datasheet Link: http://www.ti.com/lit/ds/symlink/sn75176a.pdf
U13 = W25Q16JVSSIQ: 16M-bit Serial Flash Memory with uniform 4KB sectors and Dual/Quad SPI; Manufacturer_Name: Winbond; Geometry.Height: 2.16mm; Manufacturer_Part_Number: W25Q16JVSSIQ; Mouser Part Number: 454-W25Q16JVSSIQ; Mouser Price/Stock: https://www.mouser.co.uk/ProductDetail/Winbond/W25Q16JVSSIQ?qs=qSfuJ%252Bfl%2Fd46L%2F1QrQC%2Fog%3D%3D; Arrow Part Number: W25Q16JVSSIQ; Arrow Price/Stock: https://www.arrow.com/en/products/w25q16jvssiq/winbond-electronics?region=nac; Mouser Testing Part Number: *; Mouser Testing Price/Stock: *; Datasheet Link: https://www.winbond.com/hq/search-resource-file.jsp?partNo=W25Q16JVSSIQ&type=datasheet
U14 = DS1340Z-3+: Maxim DS1340Z-3+ Real Time Clock  Calendar 8-Pin SOIC; Manufacturer_Name: Maxim Integrated; Geometry.Height: 1.75mm; Manufacturer_Part_Number: DS1340Z-3+; Mouser Part Number: 700-DS1340Z-3; Mouser Price/Stock: https://www.mouser.co.uk/ProductDetail/Maxim-Integrated/DS1340Z-3%2b?qs=1eQvB6Dk1vgZlP%2FkqXh3xQ%3D%3D; Arrow Part Number: *; Arrow Price/Stock: *; Mouser Testing Part Number: *; Mouser Testing Price/Stock: *; Datasheet Link: https://datasheets.maximintegrated.com/en/ds/DS1340-DS1340C.pdf
U15 U16 U19 U20 = MC33172DR2GH: General Purpose Amplifier 2 Circuit - 8-SOIC; MF: ON Semiconductor; Purchase-URL: https://pricing.snapeda.com/search/part/MC33172DR2GH/?ref=eda; Value: *; SnapEDA_Link: https://www.snapeda.com/parts/MC33172DR2GH/Onsemi/view-part/?ref=snap; Package: None; Check_prices: https://www.snapeda.com/parts/MC33172DR2GH/Onsemi/view-part/?ref=eda; Availability: In Stock; Price: None; MP: MC33172DR2GH
U17 = INA826AIDGKR: Precision, 200-uA Supply Current, 36-V Supply Instrumentation Amplifier; Manufacturer_Name: Texas Instruments; Geometry.Height: 1.1mm; Manufacturer_Part_Number: INA826AIDGKR; Mouser Part Number: 595-INA826AIDGKR; Mouser Price/Stock: https://www.mouser.co.uk/ProductDetail/Texas-Instruments/INA826AIDGKR?qs=RqytGdBYyUFRygOfwpYOmQ%3D%3D; Arrow Part Number: INA826AIDGKR; Arrow Price/Stock: https://www.arrow.com/en/products/ina826aidgkr/texas-instruments?region=nac; Mouser Testing Part Number: *; Mouser Testing Price/Stock: *; Datasheet Link: http://www.ti.com/lit/ds/symlink/ina826.pdf
U22 = NCP5663DSADJR4G: Linear Voltage Regulator, LDO, Fast Response, 3.0 A, with Enable Vout: Adj; Manufacturer_Name: onsemi; Geometry.Height: 4.826mm; Manufacturer_Part_Number: NCP5663DSADJR4G; Mouser Part Number: 863-NCP5663DSADJR4G; Mouser Price/Stock: https://www.mouser.co.uk/ProductDetail/onsemi/NCP5663DSADJR4G?qs=%2FugrpAKHX8rUyz7Fi%2Fgntg%3D%3D; Arrow Part Number: NCP5663DSADJR4G; Arrow Price/Stock: https://www.arrow.com/en/products/ncp5663dsadjr4g/on-semiconductor?region=nac; Mouser Testing Part Number: *; Mouser Testing Price/Stock: *; Datasheet Link: http://www.onsemi.com/pub/Collateral/NCP5663-D.PDF
U23 = SIM-ST-MFF2: GLOBAL IOT EMBEDDED SIM CHIP; Value: *; MP: SIM-ST-MFF2; Package: None; Availability: Unavailable; Price: None
U24 = SIM7200-6-0-18-00-X_REVA: 6 Position Card Connector Micro SIM Surface Mount, Right Angle Gold; MF: Global Connector Technology; MP: SIM7200-6-0-18-00-A; SnapEDA_Link: https://www.snapeda.com/parts/SIM7200-6-0-18-00-A/Global%20Connector%20Technology/view-part/812977/?ref=snap; Package: None; Price: None; Value: *; Availability: Unavailable
U25 U26 = SZNUP4114HMR6T1G: ON Semiconductor SZNUP4114HMR6T1G Quad Uni-Directional TVS Diode Array, 6-Pin TSOP; Manufacturer_Name: onsemi; Geometry.Height: 1.1mm; Manufacturer_Part_Number: SZNUP4114HMR6T1G; Mouser Part Number: 863-SZNUP4114HMR6T1G; Mouser Price/Stock: https://www.mouser.co.uk/ProductDetail/onsemi/SZNUP4114HMR6T1G?qs=3PKVEWFFm28CWuvYGXlVhA%3D%3D; Arrow Part Number: SZNUP4114HMR6T1G; Arrow Price/Stock: https://www.arrow.com/en/products/sznup4114hmr6t1g/on-semiconductor; Mouser Testing Part Number: *; Mouser Testing Price/Stock: *; Datasheet Link: https://componentsearchengine.com/Datasheets/2/SZNUP4114HMR6T1G.pdf
X3 Y1 Y2 = Thach Anh 2 chan Cam: Crystal For all Crystal 2pin.; Value: 4Mhz